# EAGLE design gyrotestbench (EAGLE 6.2)

## Sheet 1 of 9
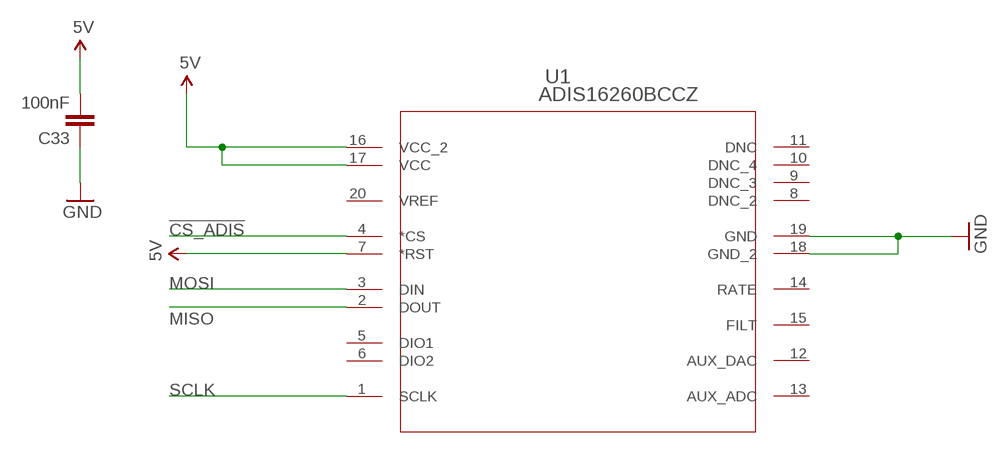
[diagram p0: schematic, sheet 1]

### Parts
C33  100nF  CAP0603-CAP  [0603-CAP]
U1  ADIS16260BCCZ  [LGA_CC-20-1]

### Nets
5V: C33.2 U1.7(*RST) U1.16(VCC_2) U1.17(VCC) ; also sheet 2,3,7,8,9
!CS_ADIS: U1.4(*CS) ; also sheet 9
GND: C33.1 U1.18(GND_2) U1.19(GND) ; also sheet 2,3,4,5,6,7,8,9
MISO: U1.2(DOUT) ; also sheet 2,7,9
MOSI: U1.3(DIN) ; also sheet 2,7,9
SCLK: U1.1(SCLK) ; also sheet 2,7,9
Unconnected: U1.5(DIO1) U1.6(DIO2) U1.8(DNC_2) U1.9(DNC_3) U1.10(DNC_4) U1.11(DNC) U1.12(AUX_DAC) U1.13(AUX_ADC) U1.14(RATE) U1.15(FILT) U1.20(VREF)

## Sheet 2 of 9
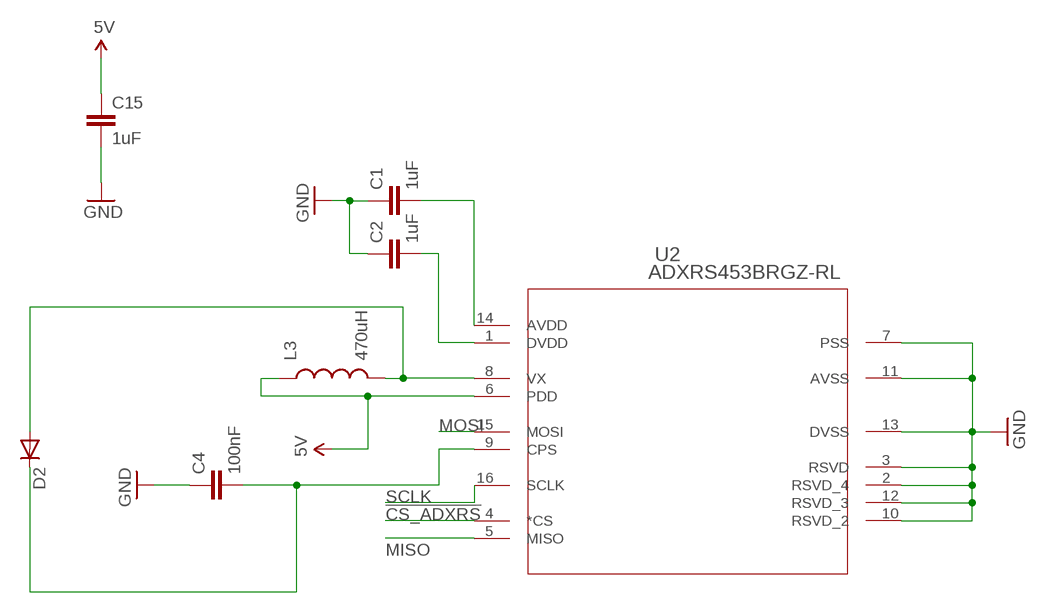
[diagram p1: schematic, sheet 2]

### Parts
C1  1uF  CAP0603-CAP  [0603-CAP]
C2  1uF  CAP0603-CAP  [0603-CAP]
C4  100nF  CAP0603-CAP  [0603-CAP]
C15  1uF  CAP0603-CAP  [0603-CAP]
D2  DIODEPTH  [DIODE-1N4001]
L3  470uH  INDUCTOR1210  [1210]
U2  ADXRS453BRGZ-RL  [RG_16_1]

### Nets
5V: C15.1 L3.1 U2.6(PDD) ; also sheet 1,3,7,8,9
!CS_ADXRS: U2.4(*CS) ; also sheet 9
GND: C1.1 C2.1 C4.1 C15.2 U2.2(RSVD_4) U2.3(RSVD) U2.7(PSS) U2.10(RSVD_2) U2.11(AVSS) U2.12(RSVD_3) U2.13(DVSS) ; also sheet 1,3,4,5,6,7,8,9
MISO: U2.5(MISO) ; also sheet 1,7,9
MOSI: U2.15(MOSI) ; also sheet 1,7,9
N$1: C1.2 U2.14(AVDD)
N$2: C2.2 U2.1(DVDD)
N$3: C4.2 D2.C U2.9(CPS)
N$4: D2.A L3.2 U2.8(VX)
SCLK: U2.16(SCLK) ; also sheet 1,7,9

## Sheet 3 of 9
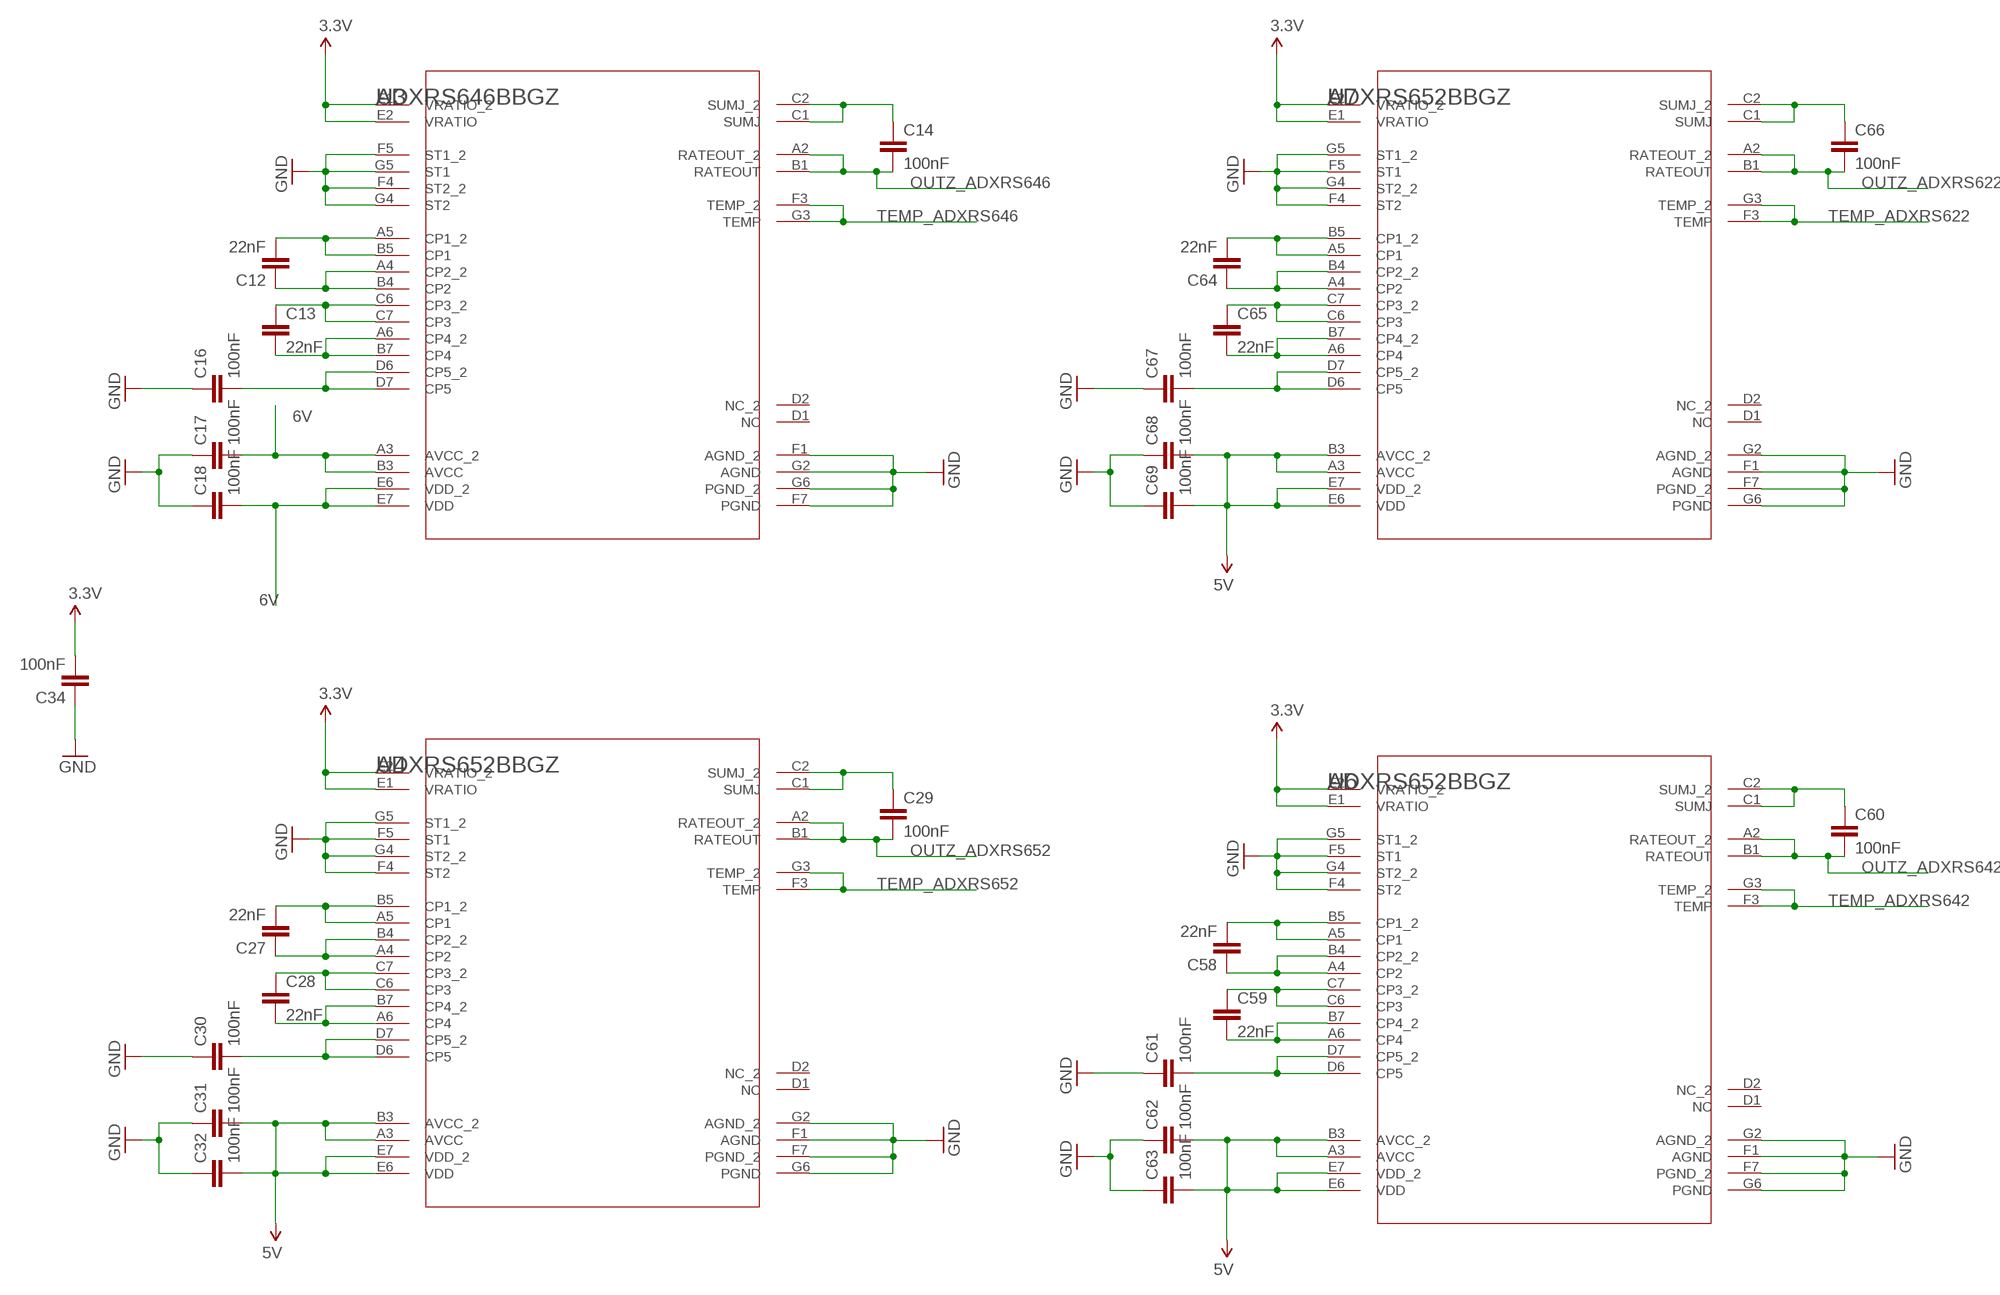
[diagram p2: schematic, sheet 3]

### Parts
C12  22nF  CAP0603-CAP  [0603-CAP]
C13  22nF  CAP0603-CAP  [0603-CAP]
C14  100nF  CAP0603-CAP  [0603-CAP]
C16  100nF  CAP0603-CAP  [0603-CAP]
C17  100nF  CAP0603-CAP  [0603-CAP]
C18  100nF  CAP0603-CAP  [0603-CAP]
C27  22nF  CAP0603-CAP  [0603-CAP]
C28  22nF  CAP0603-CAP  [0603-CAP]
C29  100nF  CAP0603-CAP  [0603-CAP]
C30  100nF  CAP0603-CAP  [0603-CAP]
C31  100nF  CAP0603-CAP  [0603-CAP]
C32  100nF  CAP0603-CAP  [0603-CAP]
C34  100nF  CAP0603-CAP  [0603-CAP]
C58  22nF  CAP0603-CAP  [0603-CAP]
C59  22nF  CAP0603-CAP  [0603-CAP]
C60  100nF  CAP0603-CAP  [0603-CAP]
C61  100nF  CAP0603-CAP  [0603-CAP]
C62  100nF  CAP0603-CAP  [0603-CAP]
C63  100nF  CAP0603-CAP  [0603-CAP]
C64  22nF  CAP0603-CAP  [0603-CAP]
C65  22nF  CAP0603-CAP  [0603-CAP]
C66  100nF  CAP0603-CAP  [0603-CAP]
C67  100nF  CAP0603-CAP  [0603-CAP]
C68  100nF  CAP0603-CAP  [0603-CAP]
C69  100nF  CAP0603-CAP  [0603-CAP]
U3  ADXRS646BBGZ  [BG_32_3]
U4  ADXRS652BBGZ  [BG_32_3]
U6  ADXRS652BBGZ  [BG_32_3]
U7  ADXRS652BBGZ  [BG_32_3]

### Nets
3.3V: C34.2 U3.E1(VRATIO_2) U3.E2(VRATIO) U4.E1(VRATIO) U4.E2(VRATIO_2) U6.E1(VRATIO) U6.E2(VRATIO_2) U7.E1(VRATIO) U7.E2(VRATIO_2) ; also sheet 4,5,6,8,9
5V: C31.2 C32.2 C62.2 C63.2 C68.2 C69.2 U4.A3(AVCC) U4.B3(AVCC_2) U4.E6(VDD) U4.E7(VDD_2) U6.A3(AVCC) U6.B3(AVCC_2) U6.E6(VDD) U6.E7(VDD_2) U7.A3(AVCC) U7.B3(AVCC_2) U7.E6(VDD) U7.E7(VDD_2) ; also sheet 1,2,7,8,9
6V: C17.2 C18.2 U3.A3(AVCC_2) U3.B3(AVCC) U3.E6(VDD_2) U3.E7(VDD) ; also sheet 8
GND: C16.1 C17.1 C18.1 C30.1 C31.1 C32.1 C34.1 C61.1 C62.1 C63.1 C67.1 C68.1 C69.1 U3.F1(AGND_2) U3.F4(ST2_2) U3.F5(ST1_2) U3.F7(PGND) U3.G2(AGND) U3.G4(ST2) U3.G5(ST1) U3.G6(PGND_2) U4.F1(AGND) U4.F4(ST2) U4.F5(ST1) U4.F7(PGND_2) U4.G2(AGND_2) U4.G4(ST2_2) U4.G5(ST1_2) U4.G6(PGND) U6.F1(AGND) U6.F4(ST2) U6.F5(ST1) U6.F7(PGND_2) U6.G2(AGND_2) U6.G4(ST2_2) U6.G5(ST1_2) U6.G6(PGND) U7.F1(AGND) U7.F4(ST2) U7.F5(ST1) U7.F7(PGND_2) U7.G2(AGND_2) U7.G4(ST2_2) U7.G5(ST1_2) U7.G6(PGND) ; also sheet 1,2,4,5,6,7,8,9
N$8: C12.2 U3.A5(CP1_2) U3.B5(CP1)
N$9: C12.1 U3.A4(CP2_2) U3.B4(CP2)
N$10: C13.1 U3.C6(CP3_2) U3.C7(CP3)
N$11: C13.2 U3.A6(CP4_2) U3.B7(CP4)
N$17: C14.1 U3.C1(SUMJ) U3.C2(SUMJ_2)
N$19: C16.2 U3.D6(CP5_2) U3.D7(CP5)
N$24: C27.2 U4.A5(CP1) U4.B5(CP1_2)
N$25: C27.1 U4.A4(CP2) U4.B4(CP2_2)
N$26: C28.1 U4.C6(CP3) U4.C7(CP3_2)
N$27: C28.2 U4.A6(CP4) U4.B7(CP4_2)
N$28: C29.1 U4.C1(SUMJ) U4.C2(SUMJ_2)
N$29: C30.2 U4.D6(CP5) U4.D7(CP5_2)
N$62: C58.2 U6.A5(CP1) U6.B5(CP1_2)
N$63: C58.1 U6.A4(CP2) U6.B4(CP2_2)
N$64: C59.1 U6.C6(CP3) U6.C7(CP3_2)
N$65: C59.2 U6.A6(CP4) U6.B7(CP4_2)
N$66: C60.1 U6.C1(SUMJ) U6.C2(SUMJ_2)
N$67: C61.2 U6.D6(CP5) U6.D7(CP5_2)
N$68: C64.2 U7.A5(CP1) U7.B5(CP1_2)
N$69: C64.1 U7.A4(CP2) U7.B4(CP2_2)
N$70: C65.1 U7.C6(CP3) U7.C7(CP3_2)
N$71: C65.2 U7.A6(CP4) U7.B7(CP4_2)
N$72: C66.1 U7.C1(SUMJ) U7.C2(SUMJ_2)
N$73: C67.2 U7.D6(CP5) U7.D7(CP5_2)
OUTZ_ADXRS622: C66.2 U7.A2(RATEOUT_2) U7.B1(RATEOUT) ; also sheet 7
OUTZ_ADXRS642: C60.2 U6.A2(RATEOUT_2) U6.B1(RATEOUT) ; also sheet 7
OUTZ_ADXRS646: C14.2 U3.A2(RATEOUT_2) U3.B1(RATEOUT) ; also sheet 7
OUTZ_ADXRS652: C29.2 U4.A2(RATEOUT_2) U4.B1(RATEOUT) ; also sheet 7
TEMP_ADXRS622: U7.F3(TEMP) U7.G3(TEMP_2) ; also sheet 7
TEMP_ADXRS642: U6.F3(TEMP) U6.G3(TEMP_2) ; also sheet 7
TEMP_ADXRS646: U3.F3(TEMP_2) U3.G3(TEMP) ; also sheet 7
TEMP_ADXRS652: U4.F3(TEMP) U4.G3(TEMP_2) ; also sheet 7
Unconnected: U3.D1(NC) U3.D2(NC_2) U4.D1(NC) U4.D2(NC_2) U6.D1(NC) U6.D2(NC_2) U7.D1(NC) U7.D2(NC_2)

## Sheet 4 of 9
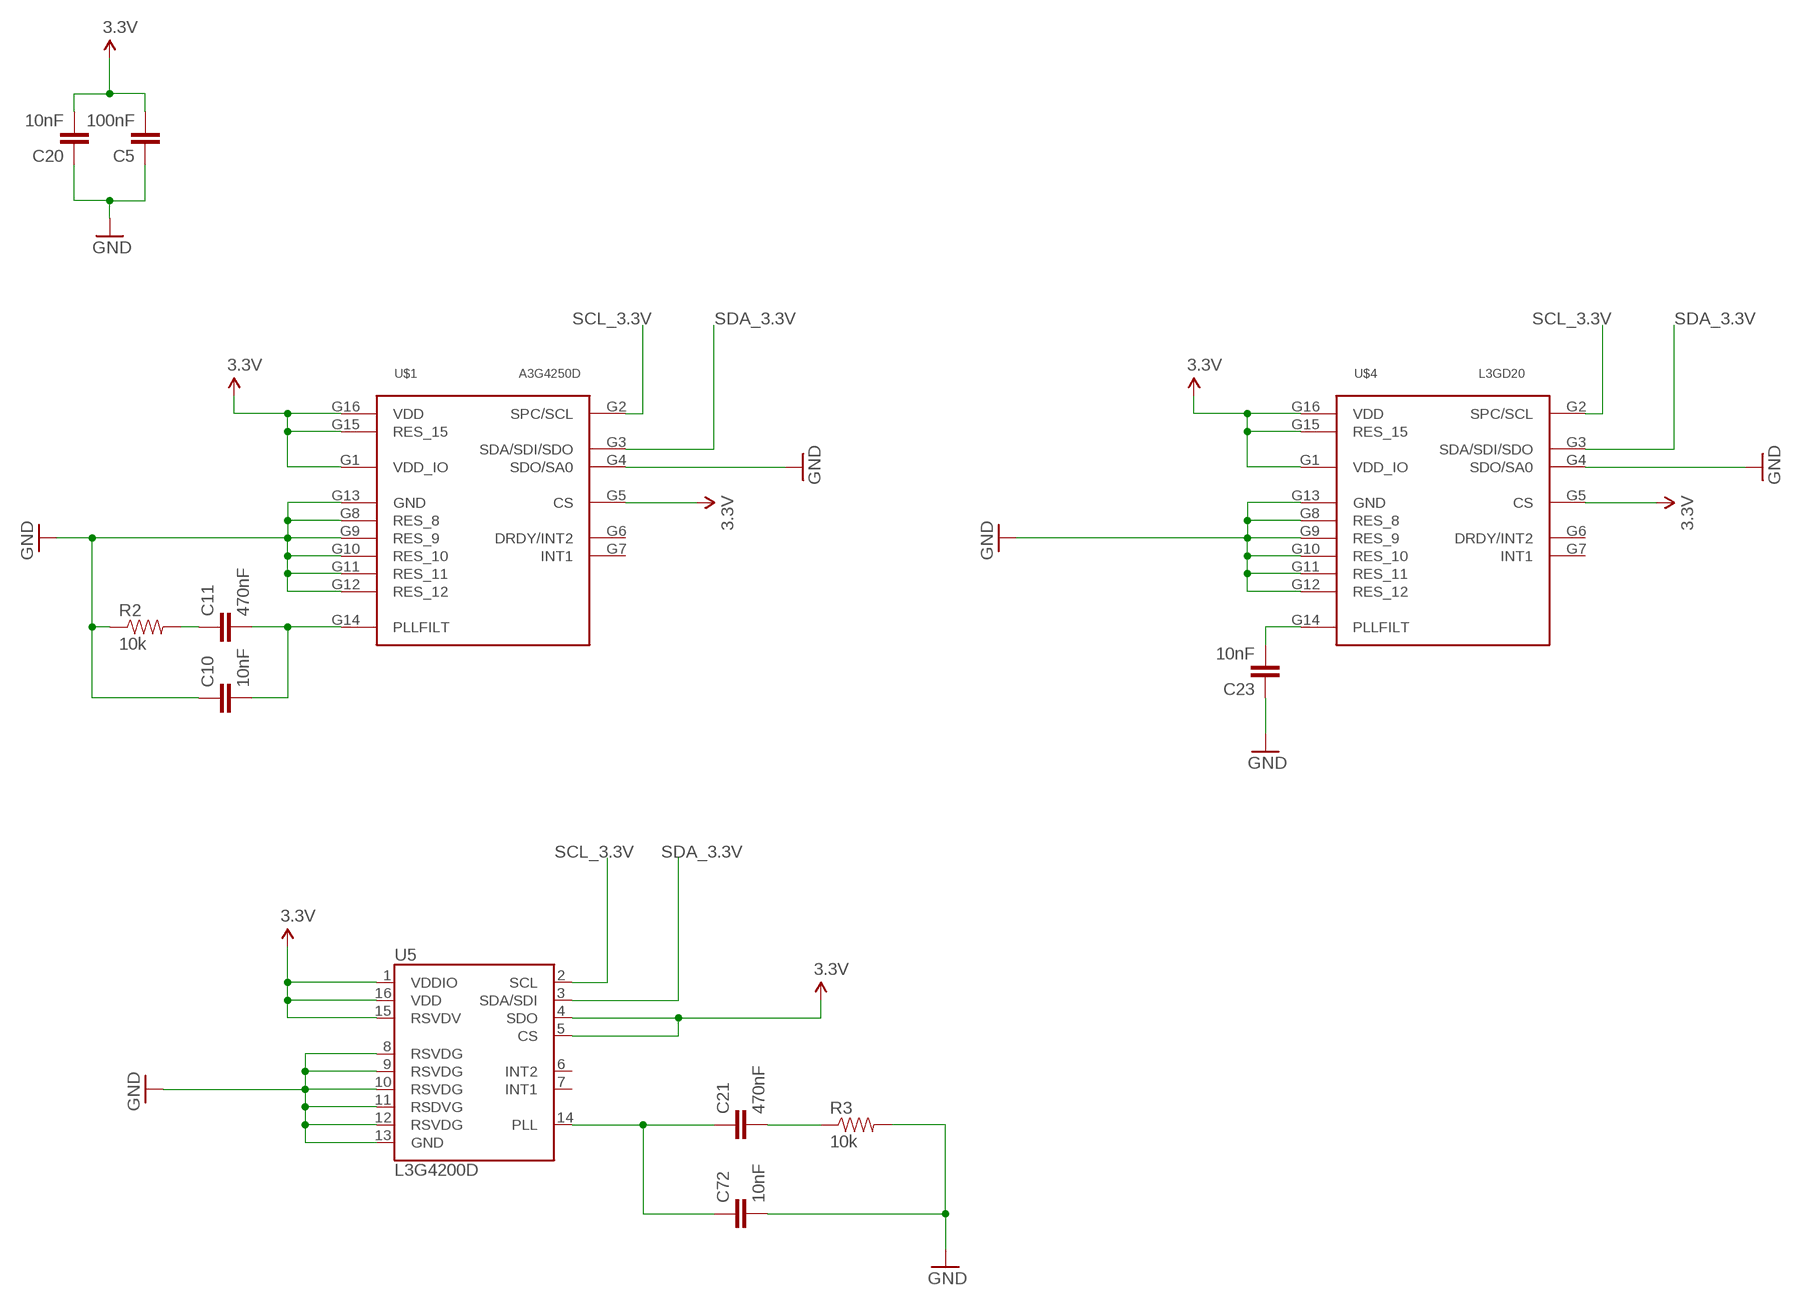
[diagram p3: schematic, sheet 4]

### Parts
C5  100nF  CAP0603-CAP  [0603-CAP]
C10  10nF  CAP0603-CAP  [0603-CAP]
C11  470nF  CAP0603-CAP  [0603-CAP]
C20  10nF  CAP0603-CAP  [0603-CAP]
C21  470nF  CAP0603-CAP  [0603-CAP]
C23  10nF  CAP0603-CAP  [0603-CAP]
C72  10nF  CAP0603-CAP  [0603-CAP]
R2  10k  RESISTOR0603-RES  [0603-RES]
R3  10k  RESISTOR0603-RES  [0603-RES]
U5  L3G4200D  [LGA16-4X4]
U$1  A3G4250D  [LGA-16]
U$4  L3GD20  [LGA-16]

### Nets
3.3V: C5.2 C20.2 U5.1(VDDIO) U5.4(SDO) U5.5(CS) U5.15(RSVDV) U5.16(VDD) U$1.G1(VDD_IO) U$1.G5(CS) U$1.G15(RES_15) U$1.G16(VDD) U$4.G1(VDD_IO) U$4.G5(CS) U$4.G15(RES_15) U$4.G16(VDD) ; also sheet 3,5,6,8,9
GND: C5.1 C10.1 C20.1 C23.1 C72.2 R2.1 R3.2 U5.8(RSVDG) U5.9(RSVDG) U5.10(RSVDG) U5.11(RSDVG) U5.12(RSVDG) U5.13(GND) U$1.G4(SDO/SA0) U$1.G8(RES_8) U$1.G9(RES_9) U$1.G10(RES_10) U$1.G11(RES_11) U$1.G12(RES_12) U$1.G13(GND) U$4.G4(SDO/SA0) U$4.G8(RES_8) U$4.G9(RES_9) U$4.G10(RES_10) U$4.G11(RES_11) U$4.G12(RES_12) U$4.G13(GND) ; also sheet 1,2,3,5,6,7,8,9
N$5: C21.1 C72.1 U5.14(PLL)
N$12: C10.2 C11.2 U$1.G14(PLLFILT)
N$13: C11.1 R2.2
N$14: C21.2 R3.1
N$15: C23.2 U$4.G14(PLLFILT)
SCL_3.3V: U5.2(SCL) U$1.G2(SPC/SCL) U$4.G2(SPC/SCL) ; also sheet 6,9
SDA_3.3V: U5.3(SDA/SDI) U$1.G3(SDA/SDI/SDO) U$4.G3(SDA/SDI/SDO) ; also sheet 6,9
Unconnected: U5.6(INT2) U5.7(INT1) U$1.G6(DRDY/INT2) U$1.G7(INT1) U$4.G6(DRDY/INT2) U$4.G7(INT1)

## Sheet 5 of 9
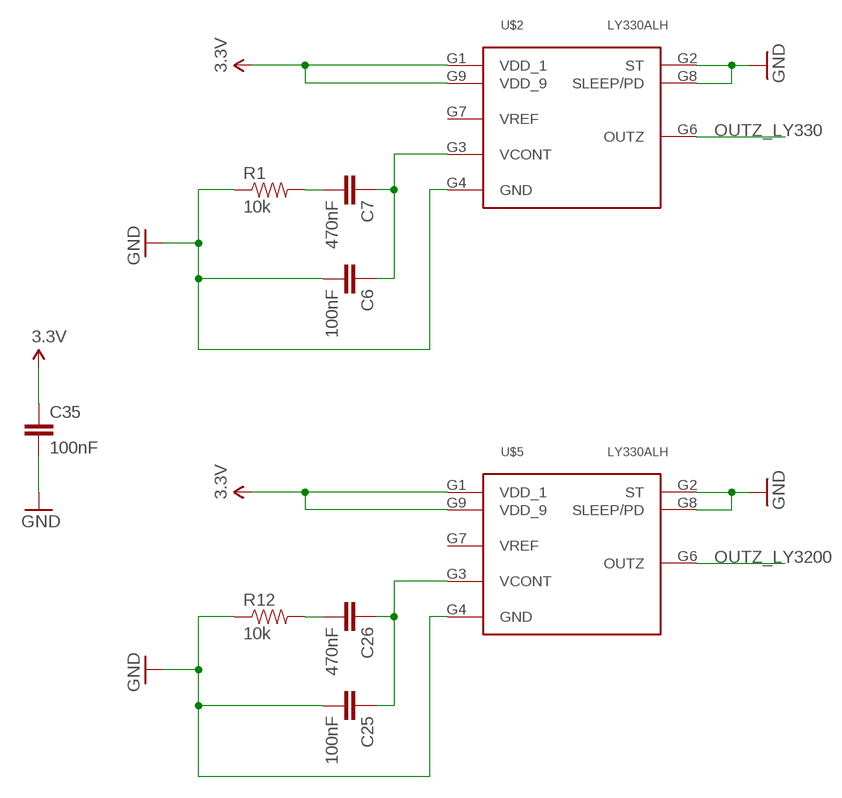
[diagram p4: schematic, sheet 5]

### Parts
C6  100nF  CAP0603-CAP  [0603-CAP]
C7  470nF  CAP0603-CAP  [0603-CAP]
C25  100nF  CAP0603-CAP  [0603-CAP]
C26  470nF  CAP0603-CAP  [0603-CAP]
C35  100nF  CAP0603-CAP  [0603-CAP]
R1  10k  RESISTOR0603-RES  [0603-RES]
R12  10k  RESISTOR0603-RES  [0603-RES]
U$2  LY330ALH  [LGA-10]
U$5  LY330ALH  [LGA-10]

### Nets
3.3V: C35.1 U$2.G1(VDD_1) U$2.G9(VDD_9) U$5.G1(VDD_1) U$5.G9(VDD_9) ; also sheet 3,4,6,8,9
GND: C6.2 C25.2 C35.2 R1.1 R12.1 U$2.G2(ST) U$2.G4(GND) U$2.G8(SLEEP/PD) U$5.G2(ST) U$5.G4(GND) U$5.G8(SLEEP/PD) ; also sheet 1,2,3,4,6,7,8,9
N$6: C7.2 R1.2
N$7: C6.1 C7.1 U$2.G3(VCONT)
N$22: C25.1 C26.1 U$5.G3(VCONT)
N$23: C26.2 R12.2
OUTZ_LY330: U$2.G6(OUTZ) ; also sheet 7
OUTZ_LY3200: U$5.G6(OUTZ) ; also sheet 7
Unconnected: U$2.G7(VREF) U$5.G7(VREF)

## Sheet 6 of 9
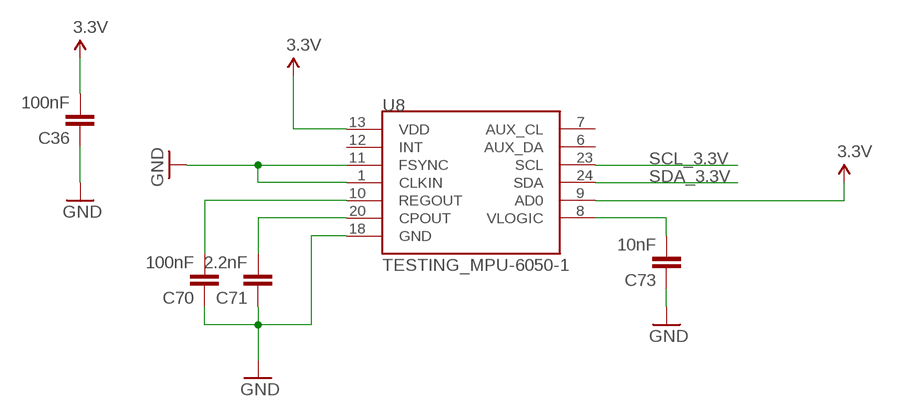
[diagram p5: schematic, sheet 6]

### Parts
C36  100nF  CAP0603-CAP  [0603-CAP]
C70  100nF  CAP0603-CAP  [0603-CAP]
C71  2.2nF  CAP0603-CAP  [0603-CAP]
C73  10nF  CAP0603-CAP  [0603-CAP]
U8  TESTING_MPU-6050-1  [TESTING_QFN-24-4MM2]

### Nets
3.3V: C36.2 U8.9(AD0) U8.13(VDD) ; also sheet 3,4,5,8,9
GND: C36.1 C70.1 C71.1 C73.1 U8.1(CLKIN) U8.11(FSYNC) U8.18(GND) ; also sheet 1,2,3,4,5,7,8,9
N$38: C70.2 U8.10(REGOUT)
N$39: C71.2 U8.20(CPOUT)
N$41: C73.2 U8.8(VLOGIC)
SCL_3.3V: U8.23(SCL) ; also sheet 4,9
SDA_3.3V: U8.24(SDA) ; also sheet 4,9
Unconnected: U8.6(AUX_DA) U8.7(AUX_CL) U8.12(INT)

## Sheet 7 of 9
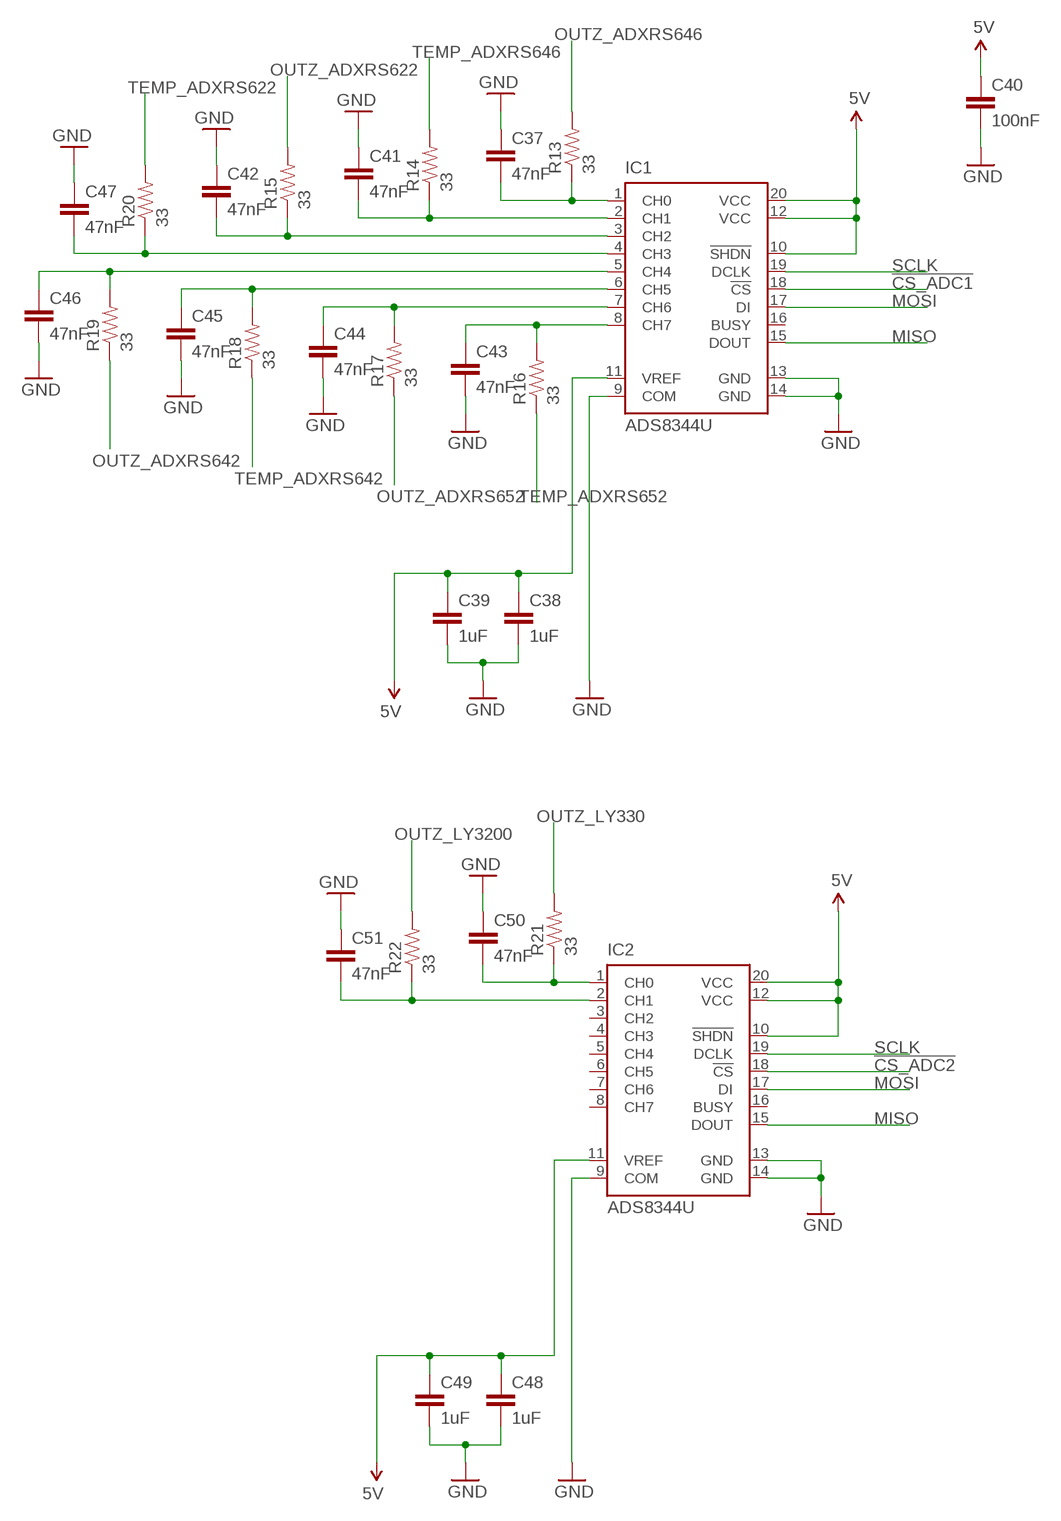
[diagram p6: schematic, sheet 7]

### Parts
C37  47nF  CAP0603-CAP  [0603-CAP]
C38  1uF  CAP0603-CAP  [0603-CAP]
C39  1uF  CAP0603-CAP  [0603-CAP]
C40  100nF  CAP0603-CAP  [0603-CAP]
C41  47nF  CAP0603-CAP  [0603-CAP]
C42  47nF  CAP0603-CAP  [0603-CAP]
C43  47nF  CAP0603-CAP  [0603-CAP]
C44  47nF  CAP0603-CAP  [0603-CAP]
C45  47nF  CAP0603-CAP  [0603-CAP]
C46  47nF  CAP0603-CAP  [0603-CAP]
C47  47nF  CAP0603-CAP  [0603-CAP]
C48  1uF  CAP0603-CAP  [0603-CAP]
C49  1uF  CAP0603-CAP  [0603-CAP]
C50  47nF  CAP0603-CAP  [0603-CAP]
C51  47nF  CAP0603-CAP  [0603-CAP]
IC1  ADS8344U  [SSOP20BU]
IC2  ADS8344U  [SSOP20BU]
R13  33  RESISTOR0603-RES  [0603-RES]
R14  33  RESISTOR0603-RES  [0603-RES]
R15  33  RESISTOR0603-RES  [0603-RES]
R16  33  RESISTOR0603-RES  [0603-RES]
R17  33  RESISTOR0603-RES  [0603-RES]
R18  33  RESISTOR0603-RES  [0603-RES]
R19  33  RESISTOR0603-RES  [0603-RES]
R20  33  RESISTOR0603-RES  [0603-RES]
R21  33  RESISTOR0603-RES  [0603-RES]
R22  33  RESISTOR0603-RES  [0603-RES]

### Nets
5V: C38.1 C39.1 C40.1 C48.1 C49.1 IC1.10(!SHDN) IC1.11(VREF) IC1.12(VCC) IC1.20(VCC) IC2.10(!SHDN) IC2.11(VREF) IC2.12(VCC) IC2.20(VCC) ; also sheet 1,2,3,8,9
!CS_ADC1: IC1.18(!CS) ; also sheet 9
!CS_ADC2: IC2.18(!CS) ; also sheet 9
GND: C37.1 C38.2 C39.2 C40.2 C41.1 C42.1 C43.2 C44.2 C45.2 C46.2 C47.1 C48.2 C49.2 C50.1 C51.1 IC1.9(COM) IC1.13(GND) IC1.14(GND) IC2.9(COM) IC2.13(GND) IC2.14(GND) ; also sheet 1,2,3,4,5,6,8,9
MISO: IC1.15(DOUT) IC2.15(DOUT) ; also sheet 1,2,9
MOSI: IC1.17(DI) IC2.17(DI) ; also sheet 1,2,9
N$30: C37.2 IC1.1(CH0) R13.1
N$31: C41.2 IC1.2(CH1) R14.1
N$32: C42.2 IC1.3(CH2) R15.1
N$33: C43.1 IC1.8(CH7) R16.2
N$34: C44.1 IC1.7(CH6) R17.2
N$35: C45.1 IC1.6(CH5) R18.2
N$36: C47.2 IC1.4(CH3) R20.1
N$37: C46.1 IC1.5(CH4) R19.2
N$46: C50.2 IC2.1(CH0) R21.1
N$47: C51.2 IC2.2(CH1) R22.1
OUTZ_ADXRS622: R15.2 ; also sheet 3
OUTZ_ADXRS642: R19.1 ; also sheet 3
OUTZ_ADXRS646: R13.2 ; also sheet 3
OUTZ_ADXRS652: R17.1 ; also sheet 3
OUTZ_LY330: R21.2 ; also sheet 5
OUTZ_LY3200: R22.2 ; also sheet 5
SCLK: IC1.19(DCLK) IC2.19(DCLK) ; also sheet 1,2,9
TEMP_ADXRS622: R20.2 ; also sheet 3
TEMP_ADXRS642: R18.1 ; also sheet 3
TEMP_ADXRS646: R14.2 ; also sheet 3
TEMP_ADXRS652: R16.1 ; also sheet 3
Unconnected: IC1.16(BUSY) IC2.3(CH2) IC2.4(CH3) IC2.5(CH4) IC2.6(CH5) IC2.7(CH6) IC2.8(CH7) IC2.16(BUSY)

## Sheet 8 of 9
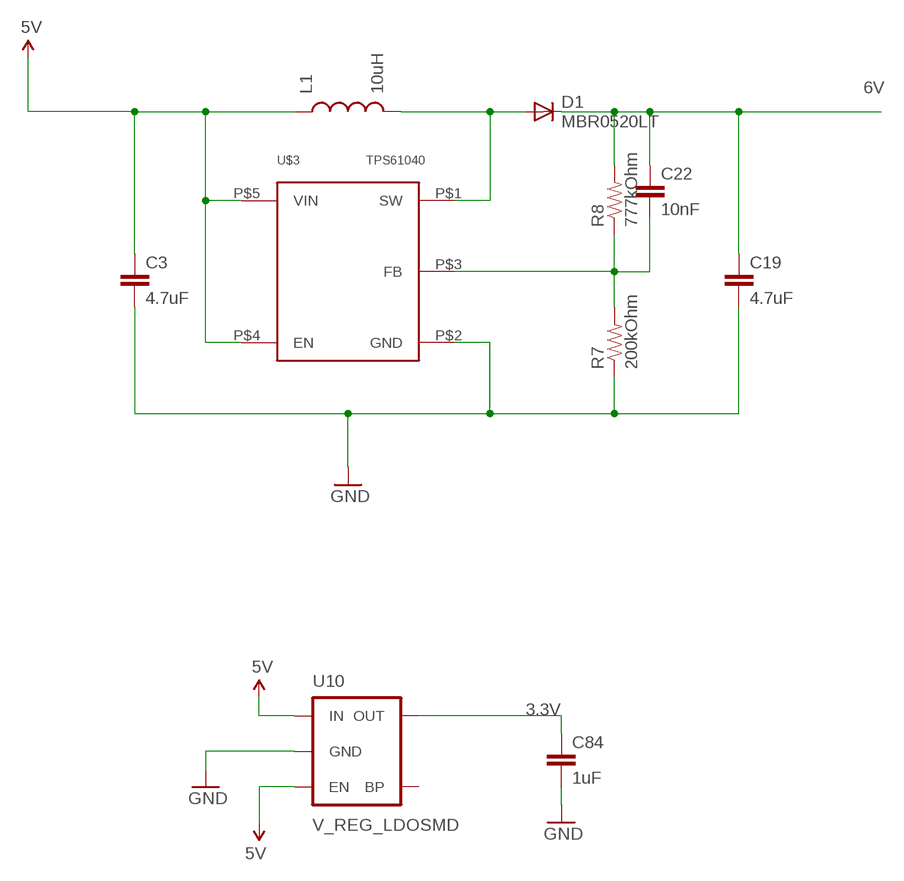
[diagram p7: schematic, sheet 8]

### Parts
C3  4.7uF  CAP0603-CAP  [0603-CAP]
C19  4.7uF  CAP0603-CAP  [0603-CAP]
C22  10nF  CAP0603-CAP  [0603-CAP]
C84  1uF  CAP0603-CAP  [0603-CAP]
D1  MBR0520LT  [SOD123]
L1  10uH  INDUCTOR1210  [1210]
R7  200kOhm  RESISTOR0603-RES  [0603-RES]
R8  777kOhm  RESISTOR0603-RES  [0603-RES]
U10  V_REG_LDOSMD  [SOT23-5]
U$3  TPS61040  [DBV]

### Nets
3.3V: C84.1 U10.5(OUT) ; also sheet 3,4,5,6,9
5V: C3.1 L1.1 U10.1(IN) U10.3(EN) U$3.P$4(EN) U$3.P$5(VIN) ; also sheet 1,2,3,7,9
6V: C19.1 C22.1 D1.C R8.2 ; also sheet 3
GND: C3.2 C19.2 C84.2 R7.1 U10.2(GND) U$3.P$2(GND) ; also sheet 1,2,3,4,5,6,7,9
N$18: D1.A L1.2 U$3.P$1(SW)
N$20: C22.2 R7.2 R8.1 U$3.P$3(FB)
Unconnected: U10.4(BP)

## Sheet 9 of 9
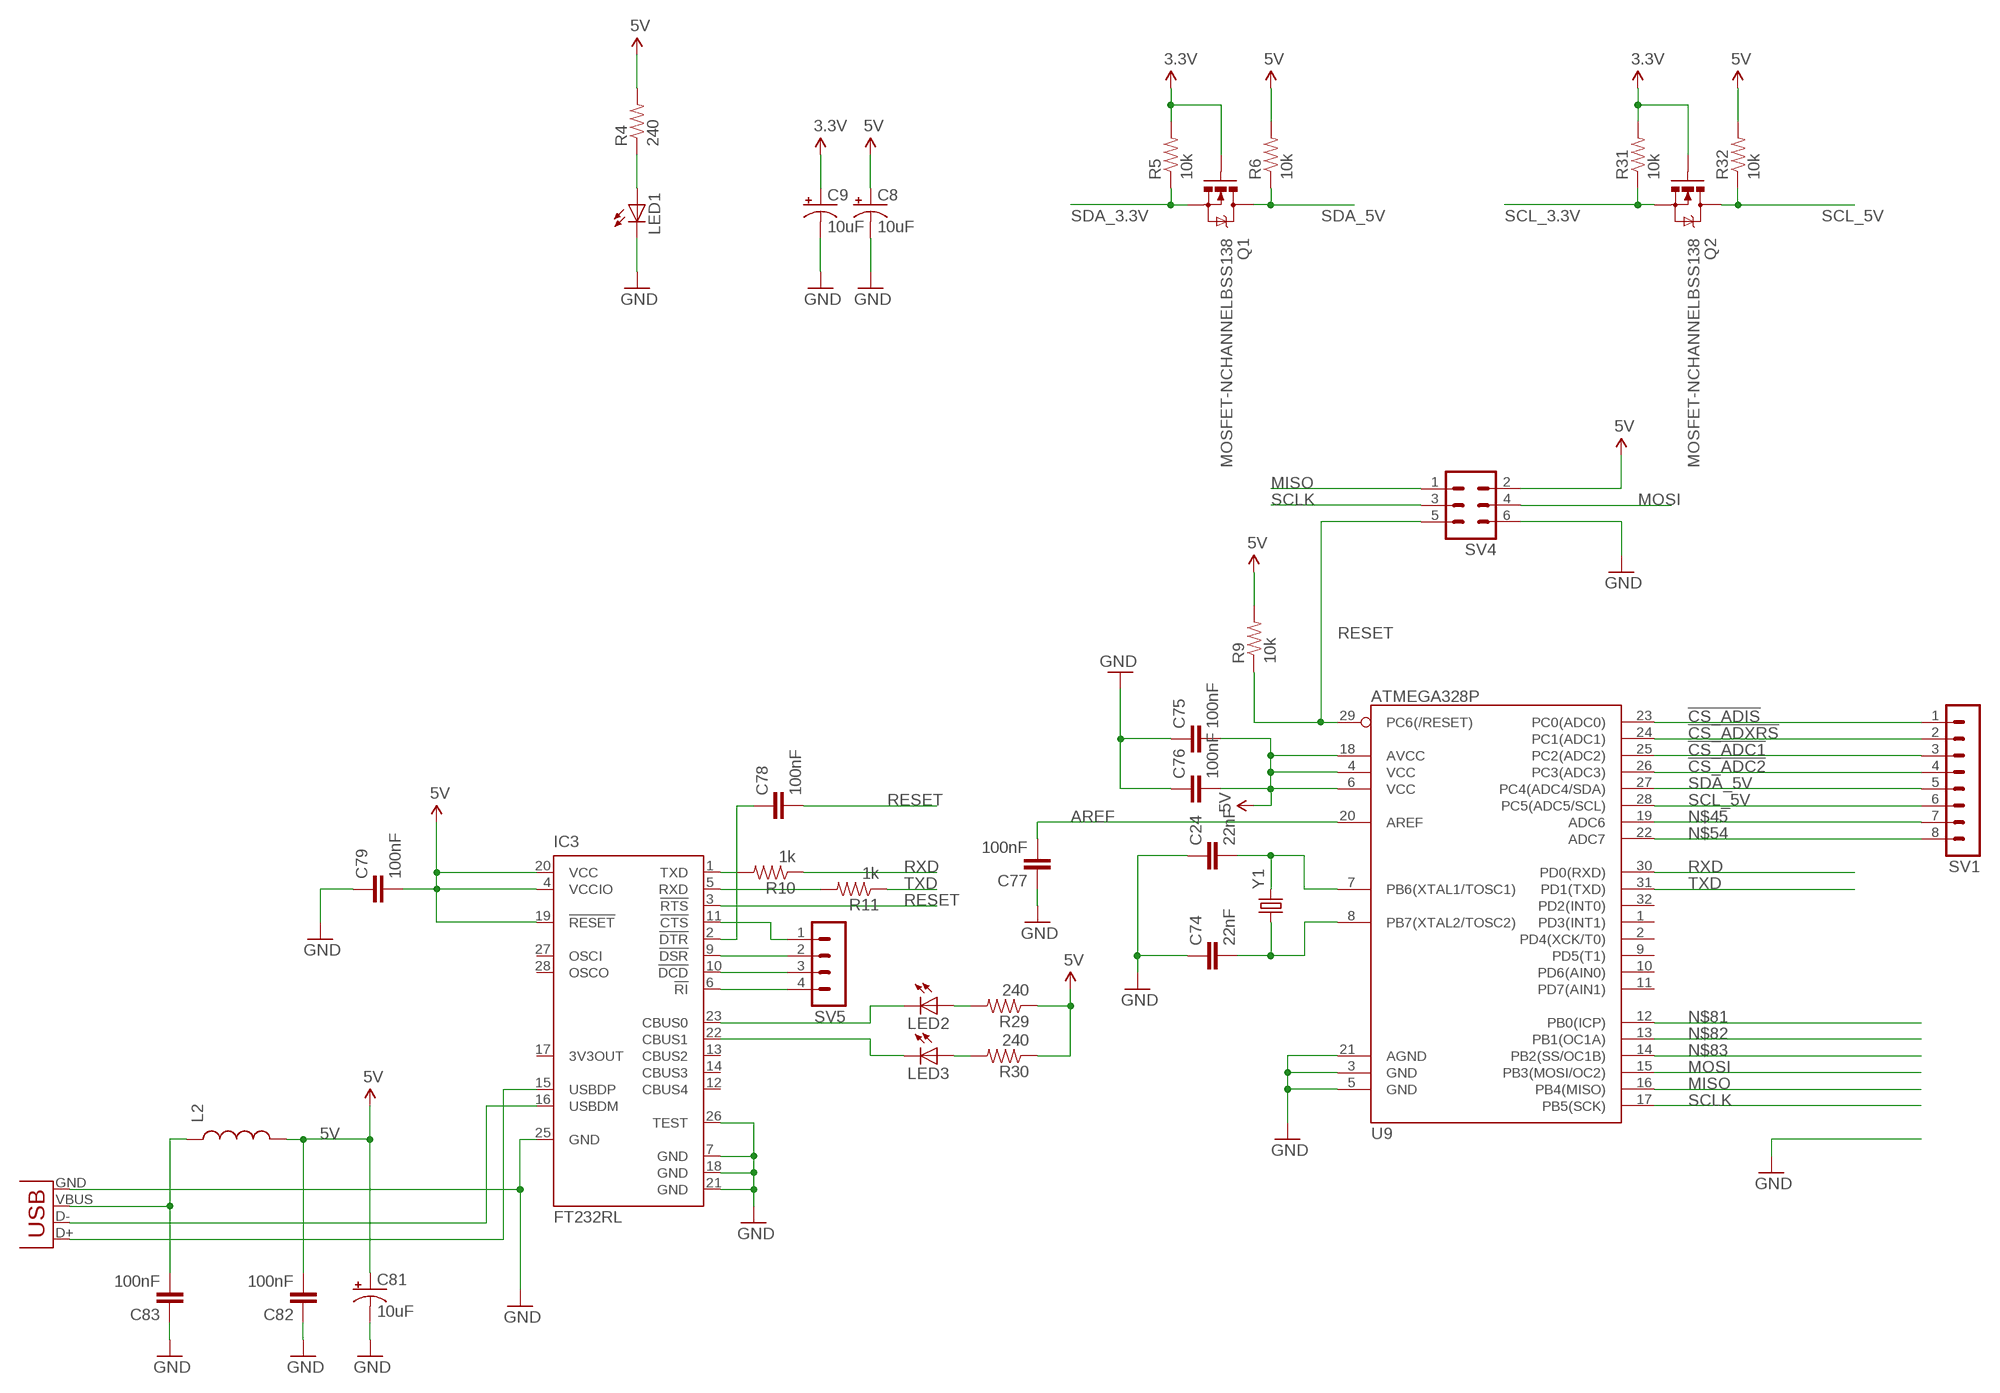
[diagram p8: schematic, sheet 9]

### Parts
C8  10uF  CPOL-USB  [PANASONIC_B]
C9  10uF  CPOL-USB  [PANASONIC_B]
C24  22nF  CAP0603-CAP  [0603-CAP]
C74  22nF  CAP0603-CAP  [0603-CAP]
C75  100nF  CAP0603-CAP  [0603-CAP]
C76  100nF  CAP0603-CAP  [0603-CAP]
C77  100nF  CAP0603-CAP  [0603-CAP]
C78  100nF  CAP0603-CAP  [0603-CAP]
C79  100nF  CAP0603-CAP  [0603-CAP]
C81  10uF  CPOL-USB  [PANASONIC_B]
C82  100nF  CAP0603-CAP  [0603-CAP]
C83  100nF  CAP0603-CAP  [0603-CAP]
IC3  FT232RL  [SSOP28]
JP1  USBSMD  [USB-MINIB]
L2  INDUCTOR0603  [0603]
LED1  LED0603  [LED-0603]
LED2  LED0603  [LED-0603]
LED3  LED0603  [LED-0603]
Q1  MOSFET-NCHANNELBSS138  [SOT23]
Q2  MOSFET-NCHANNELBSS138  [SOT23]
R4  240  RESISTOR0603-RES  [0603-RES]
R5  10k  RESISTOR0603-RES  [0603-RES]
R6  10k  RESISTOR0603-RES  [0603-RES]
R9  10k  RESISTOR0603-RES  [0603-RES]
R10  1k  RESISTOR0603-RES  [0603-RES]
R11  1k  RESISTOR0603-RES  [0603-RES]
R29  240  RESISTOR0603-RES  [0603-RES]
R30  240  RESISTOR0603-RES  [0603-RES]
R31  10k  RESISTOR0603-RES  [0603-RES]
R32  10k  RESISTOR0603-RES  [0603-RES]
SV1  MA08-1  [MA08-1]
SV4  MA03-2  [MA03-2]
SV5  MA04-1  [MA04-1]
U9  ATMEGA328P  ATMEGA328_SMT  [TQFP32-08]
Y1  CRYSTALHC49US  [HC49US]

### Nets
3.3V: C9.+ Q1.1(G) Q2.1(G) R5.2 R31.2 ; also sheet 3,4,5,6,8
5V: C8.+ C75.2 C76.2 C79.2 C81.+ C82.2 IC3.4(VCCIO) IC3.19(!RESET) IC3.20(VCC) L2.2 R4.2 R6.2 R9.2 R29.1 R30.1 R32.2 SV4.2 U9.4(VCC) U9.6(VCC) U9.18(AVCC) ; also sheet 1,2,3,7,8
!CS_ADC1: SV1.3 U9.25(PC2(ADC2)) ; also sheet 7
!CS_ADC2: SV1.4 U9.26(PC3(ADC3)) ; also sheet 7
!CS_ADIS: SV1.1 U9.23(PC0(ADC0)) ; also sheet 1
!CS_ADXRS: SV1.2 U9.24(PC1(ADC1)) ; also sheet 2
AREF: C77.2 U9.20(AREF)
GND: C8.- C9.- C24.1 C74.1 C75.1 C76.1 C77.1 C79.1 C81.- C82.1 C83.1 IC3.7(GND) IC3.18(GND) IC3.21(GND) IC3.25(GND) IC3.26(TEST) JP1.GND LED1.C SV4.6 U9.3(GND) U9.5(GND) U9.21(AGND) ; also sheet 1,2,3,4,5,6,7,8
MISO: SV4.1 U9.16(PB4(MISO)) ; also sheet 1,2,7
MOSI: SV4.4 U9.15(PB3(MOSI/OC2)) ; also sheet 1,2,7
N$45: SV1.7 U9.19(ADC6)
N$54: SV1.8 U9.22(ADC7)
N$55: IC3.1(TXD) R10.2
N$74: C78.1 IC3.2(!DTR)
N$81: U9.12(PB0(ICP))
N$82: U9.13(PB1(OC1A))
N$83: U9.14(PB2(SS/OC1B))
N$84: IC3.5(RXD) R11.2
N$85: IC3.11(!CTS) SV5.1
N$86: IC3.9(!DSR) SV5.2
N$87: C24.2 U9.7(PB6(XTAL1/TOSC1)) Y1.2
N$88: C74.2 U9.8(PB7(XTAL2/TOSC2)) Y1.1
N$89: LED1.A R4.1
N$91: IC3.10(!DCD) SV5.3
N$92: IC3.6(!RI) SV5.4
N$93: IC3.23(CBUS0) LED2.C
N$94: IC3.22(CBUS1) LED3.C
N$95: LED2.A R29.2
N$96: LED3.A R30.2
N$98: IC3.15(USBDP) JP1.D+
N$99: IC3.16(USBDM) JP1.D-
N$101: C83.2 JP1.VBUS L2.1
RESET: C78.2 IC3.3(!RTS) R9.1 SV4.5 U9.29(PC6(/RESET))
RXD: R10.1 U9.30(PD0(RXD))
SCL_3.3V: Q2.2(S) R31.1 ; also sheet 4,6
SCL_5V: Q2.3(D) R32.1 SV1.6 U9.28(PC5(ADC5/SCL))
SCLK: SV4.3 U9.17(PB5(SCK)) ; also sheet 1,2,7
SDA_3.3V: Q1.2(S) R5.1 ; also sheet 4,6
SDA_5V: Q1.3(D) R6.1 SV1.5 U9.27(PC4(ADC4/SDA))
TXD: R11.1 U9.31(PD1(TXD))
Unconnected: IC3.12(CBUS4) IC3.13(CBUS2) IC3.14(CBUS3) IC3.17(3V3OUT) IC3.27(OSCI) IC3.28(OSCO) U9.1(PD3(INT1)) U9.2(PD4(XCK/T0)) U9.9(PD5(T1)) U9.10(PD6(AIN0)) U9.11(PD7(AIN1)) U9.32(PD2(INT0))

## Library data of the parts
C1-C7 C10-C51 C58-C79 C82-C84 = SparkFun-Capacitors:CAP: Capacitor Standard 0603 ceramic capacitor, and 0.1" leaded capacitor.
C8 C9 C81 = rcl:CPOL-US: POLARIZED CAPACITOR, American symbol
D1 = diode:MBR0520LT: SCHOTTKY BARRIER RECTIFIER Source: http://onsemi.com .. MBR0520LT1-D.pdf
D2 = SparkFun-DiscreteSemi:DIODE: Diode These are standard reverse protection diodes and small signal diodes. SMA package can handle up to about 1A. SOD-323 can handle about 200mA. What the SOD-323 package when ordering, there are some mfgs out there that are 5-pin packages.
IC1 IC2 = burr-brown:ADS8344: 16-Bit, 8-Channel Serial Output Sampling ADC; MPN: ADS8344NB; OC_FARNELL: 1212294; OC_NEWARK: 01M6827
IC3 = ftdichip:FT232R: Source: http://www.ftdichip.com/Documents/DataSheets/DS_FT232R_v104.pdf; MPN: FT232RL; OC_FARNELL: 1146032; OC_NEWARK: 91K9918
JP1 = SparkFun-Connectors:USB: USB Connectors USB-B-PTH is fully proven SKU : PRT-00139/CONN-08278 USB-miniB is fully proven SKU : PRT-00587 USB-A-PCB is untested. USB-A-H is throughly reviewed, but untested. Spark Fun Electronics SKU : PRT-00437 USB-B-SMT is throughly reviewed, but untested. Needs silkscreen touching up. USB-A-S has not been used/tested USB-MB-H has not been used/tested USB-MICROB has been used. CONN-09505
L1-L3 = SparkFun-Passives:INDUCTOR: Inductors Basic Inductor/Choke - 0603 and 1206. Footprints are not proven and vary greatly between part numbers.
LED1-LED3 = SparkFun-LED:LED: LEDs Standard schematic elements and footprints for 5mm, 3mm, 1206, and 0603 sized LEDs. 5mm - Spark Fun Electronics SKU : COM-00529 (and others)
Q1 Q2 = SparkFun-DiscreteSemi:MOSFET-NCHANNEL: Common NMOSFET Parts MFG P/N Store ID Prod ID FDD8780 TRANS-09984 SI7820DN TRANS-11055 FDS6630A IC-08089 2N7002PW TRANS-11151 FQP30N06L COM-10213 TRANS-10060 BSS123LT1G TRANS-08345 BSS138 TRANS-00830 BS170 2N7000; PROD_ID: TRANS-00830
R1-R22 R29-R32 = SparkFun-Resistors:RESISTOR: Resistor Basic schematic elements and footprints for 0603, 1206, and PTH resistors.
SV1 = con-lstb:MA08-1: PIN HEADER; OC_FARNELL: unknown; OC_NEWARK: unknown
SV4 = con-lstb:MA03-2: PIN HEADER; OC_FARNELL: unknown; OC_NEWARK: unknown
SV5 = con-lstb:MA04-1: PIN HEADER; OC_FARNELL: unknown; OC_NEWARK: unknown
U1 = gyrolib:ADIS16260BCCZ
U2 = gyrolib:ADXRS453BRGZ-RL
U3 = gyrolib:ADXRS646BBGZ; MANUFACTURER_PART_NUMBER: ADXRS613BBGZ; VENDOR: Vendor
U4 U6 U7 = gyrolib:ADXRS652BBGZ
U5 = SparkFun-Sensors:L3G4200D: L3G4200D Three-axis, digital output gyroscope The L3G4200D is a low-power three-axis angular rate sensor, has a full scale of ±250/±500/±2000 dps and is capable of measuring rates with a user-selectable bandwidth. It includes a sensing element and an IC interface capable of providing the measured angular rate to the external world through a digital interface (I2C/SPI). Package: 4x4x1.1 LGA-16 (LGA16-4x4.PAC)
U8 = MPU-6050_Breakout_V11:TESTING_MPU-6050
U9 = SparkFun-DigitalIC:ATMEGA328_SMT: 32-Pin Atmega328 part Commonly used on Arduino compatible boards Available in QFP and QFN packages TQFP is IC-09069 QFN is non-stock; PROD_ID: IC-09069
U10 = SparkFun-PowerIC:V_REG_LDO: Voltage Regulator LDO Standard 150mA LDO voltage regulator in SOT-23 layout. Micrel part MIC5205. BP (by-pass) pin is used to lower output noise with 470pF cap.
U$1 = gyrolib:A3G4250D
U$2 U$5 = gyrolib:LY330ALH
U$3 = gyrolib:TPS61040
U$4 = gyrolib:L3GD20
Y1 = SparkFun-FreqCtrl:CRYSTAL: Various standard crystals. Proven footprints. Spark Fun Electronics SKU : COM-00534

## Board
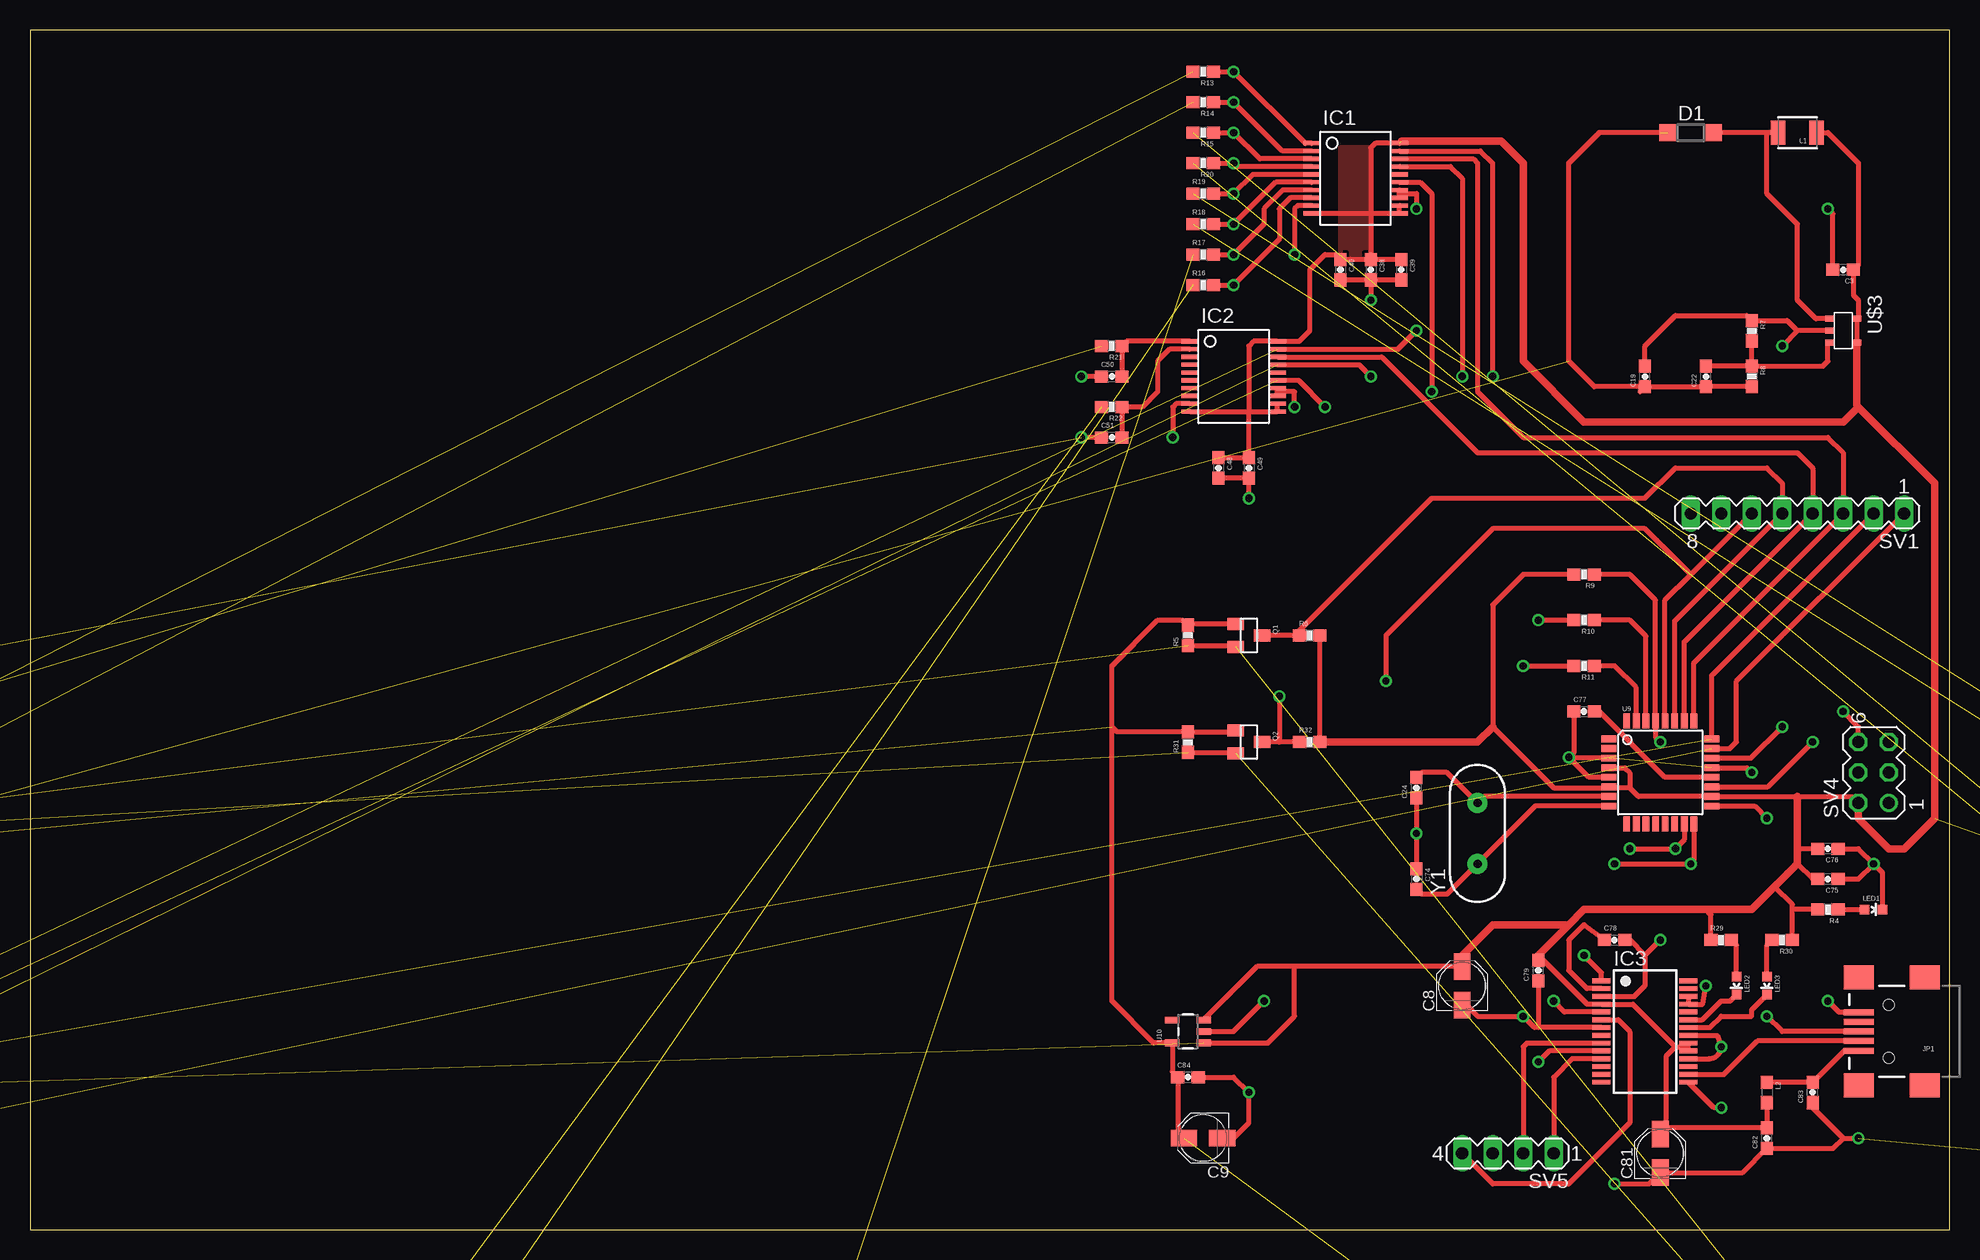
[diagram p9: board, top side]
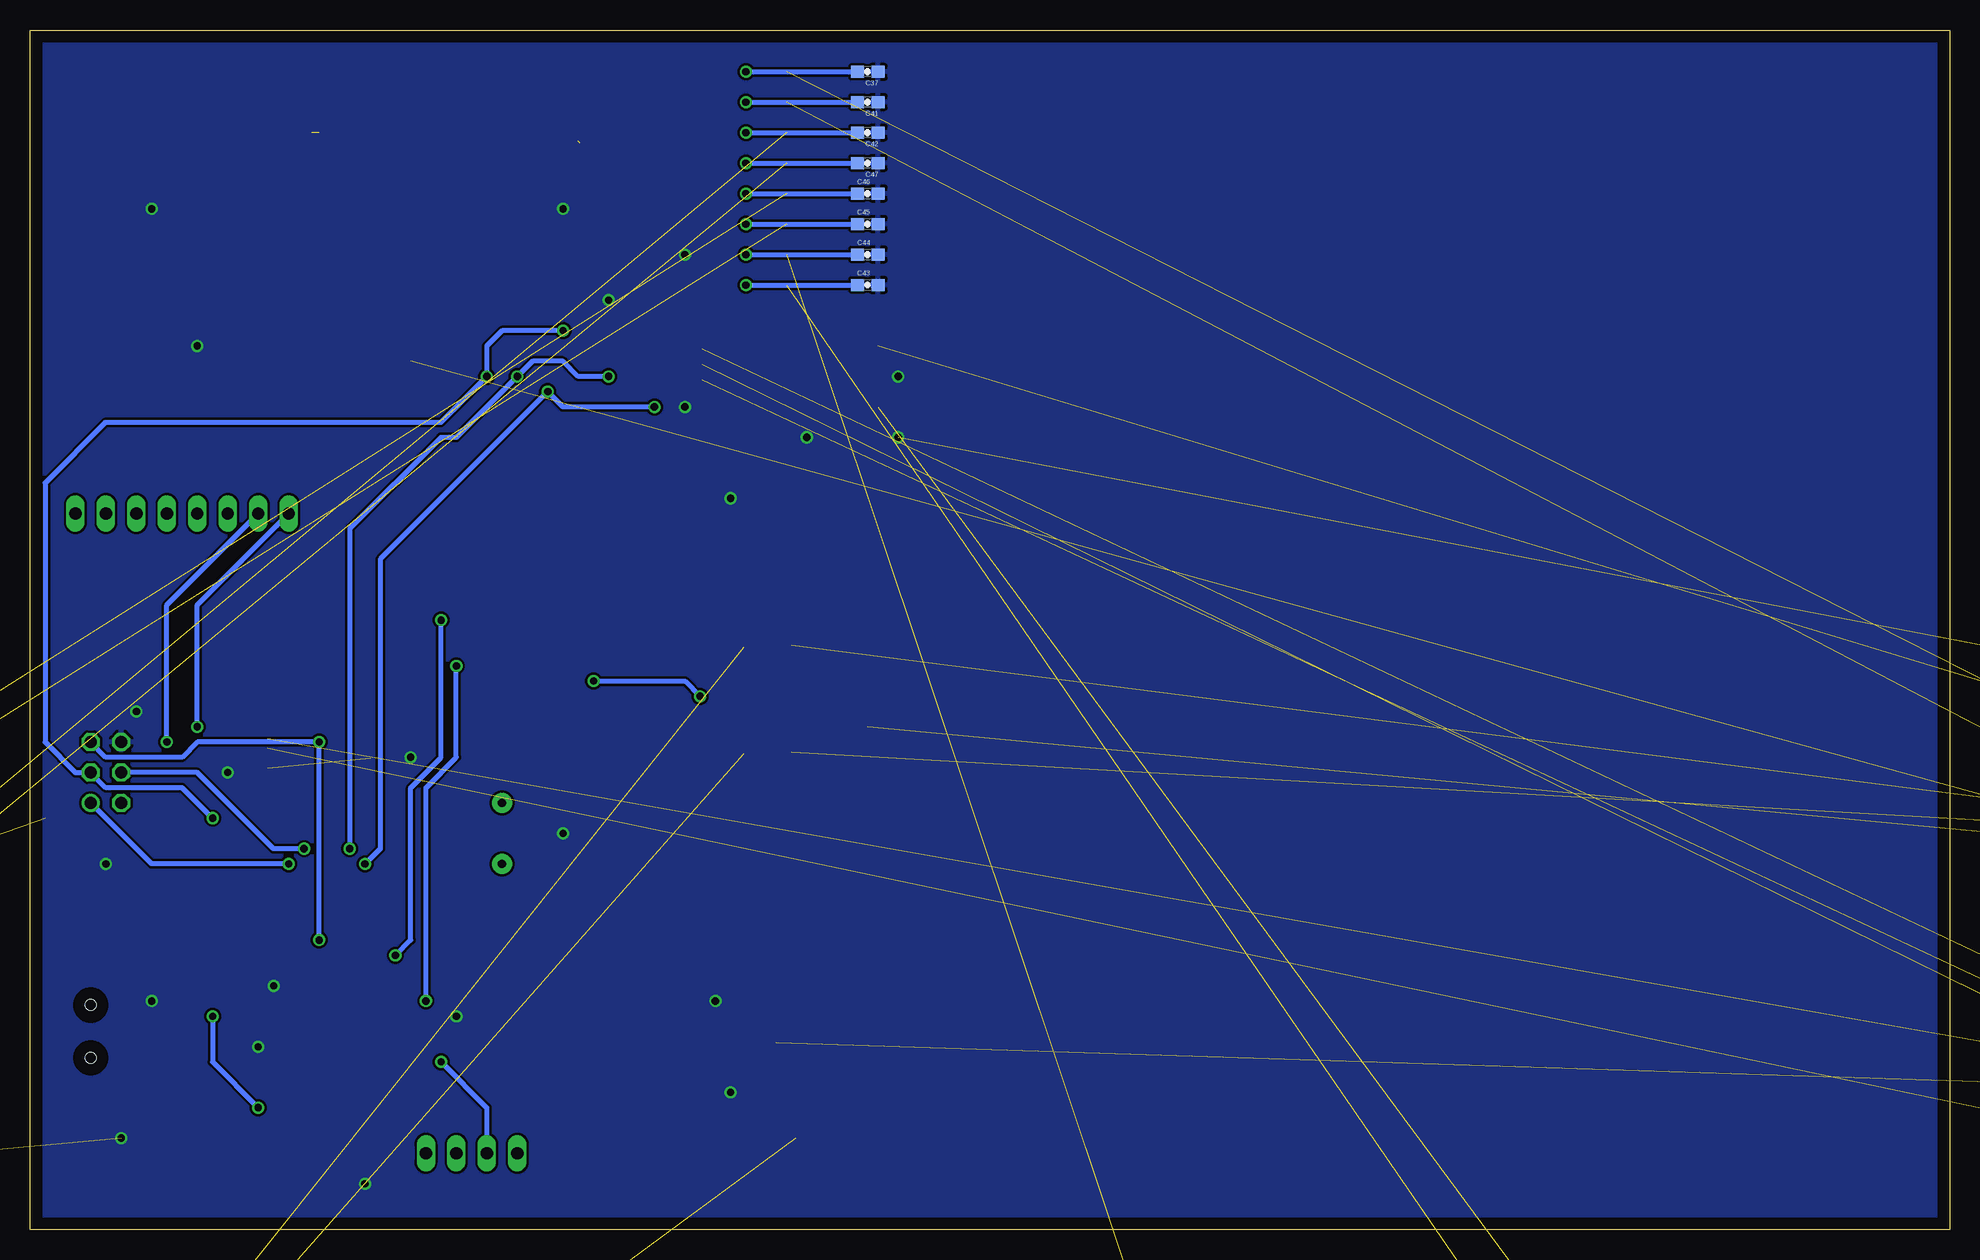
[diagram p10: board, bottom side, seen from below]

Size 160 x 100 mm. Coordinates in mm from the lower left corner, seen from the top.
Outline: 0,0 160,0 160,100 0,100 0,0
Copper layers (1*16): Top 0.035mm / dielectric 1.5mm / Bottom 0.035mm
Design rules: minimum track width 10mil, minimum drill 24mil, track to track 8mil, track to pad 8mil, pad to pad 8mil, via to via 8mil, smd to smd 8mil, copper to edge 40mil, drill to drill 8mil, minimum pad ring 10mil, minimum via ring 8mil, stop-mask expansion 4mil, vias tented up to drill 0mil, thermal gap 10mil

### Footprints (pad centres in the part's own frame; a part is rotated, then mirrored left to right if it is on the bottom)
0603-CAP = smd 1.1 x 1: 1 -0.85,0; 2 0.85,0
PANASONIC_B = smd 2.2 x 1.4: + 1.6,0; - -1.6,0
SOD123 = smd 1.4 x 1.4: A 1.9,0; C -1.9,0
DIODE-1N4001 = drill 1 pad 1.981: A -5.08,0; C 5.08,0
SSOP20BU = smd 0.348 x 1.397: 1 -2.925,-3.656; 2 -2.275,-3.656; 3 -1.625,-3.656; 4 -0.975,-3.656; 5 -0.325,-3.656; 6 0.325,-3.656; 7 0.975,-3.656; 8 1.625,-3.656; 9 2.275,-3.656; 10 2.925,-3.656; 11 2.925,3.656; 12 2.275,3.656; 13 1.625,3.656; 14 0.975,3.656; 15 0.325,3.656; 16 -0.325,3.656; 17 -0.975,3.656; 18 -1.625,3.656; 19 -2.275,3.656; 20 -2.925,3.656
SSOP28 = smd 0.4 x 1.5: 1 -4.225,-3.625; 2 -3.575,-3.625; 3 -2.925,-3.625; 4 -2.275,-3.625; 5 -1.625,-3.625; 6 -0.975,-3.625; 7 -0.325,-3.625; 8 0.325,-3.625; 9 0.975,-3.625; 10 1.625,-3.625; 11 2.275,-3.625; 12 2.925,-3.625; 13 3.575,-3.625; 14 4.225,-3.625; 15 4.225,3.625; 16 3.575,3.625; 17 2.925,3.625; 18 2.275,3.625; 19 1.625,3.625; 20 0.975,3.625; 21 0.325,3.625; 22 -0.325,3.625; 23 -0.975,3.625; 24 -1.625,3.625; 25 -2.275,3.625; 26 -2.925,3.625; 27 -3.575,3.625; 28 -4.225,3.625
USB-MINIB = smd 2.5 x 0.5: D+ 2.5,0; D- 2.5,0.8; GND 2.5,-1.6; ID 2.5,-0.8; VBUS 2.5,1.6 | smd 2.5 x 2: MTN1 -3,4.5; MTN2 2.5,4.5; MTN3 -3,-4.5; MTN4 2.5,-4.5 | hole 0.9: 0,2.2; 0,-2.2
1210 = smd 1.2 x 2: 1 -1.6,0; 2 1.6,0
0603 = smd 1.1 x 1: 1 -0.85,0; 2 0.85,0
LED-0603 = smd 0.8 x 0.8: A 0,-0.75; C 0,0.75
SOT23 = smd 1 x 1.4: 1 -0.95,-1.1; 2 0.95,-1.1; 3 0,1.1
0603-RES = smd 1.1 x 1: 1 -0.85,0; 2 0.85,0
MA08-1 = drill 1.016 long: 1 -8.89,0; 2 -6.35,0; 3 -3.81,0; 4 -1.27,0; 5 1.27,0; 6 3.81,0; 7 6.35,0; 8 8.89,0
MA03-2 = drill 1.016: 1 -2.54,-1.27 | drill 1.016 octagon: 2 -2.54,1.27; 3 0,-1.27; 4 0,1.27; 5 2.54,-1.27; 6 2.54,1.27
MA04-1 = drill 1.016 long: 1 -3.81,0; 2 -1.27,0; 3 1.27,0; 4 3.81,0
LGA_CC-20-1 = smd 0.686 x 0.991: 1 -5.436,3.81; 2 -5.436,1.905; 3 -5.436,0; 4 -5.436,-1.905; 5 -5.436,-3.81; 11 5.436,-3.81; 12 5.436,-1.905; 13 5.436,0; 14 5.436,1.905; 15 5.436,3.81 | smd 0.991 x 0.686: 6 -3.81,-5.359; 7 -1.905,-5.359; 8 0,-5.359; 9 1.905,-5.359; 10 3.81,-5.359; 16 3.81,5.359; 17 1.905,5.359; 18 0,5.359; 19 -1.905,5.359; 20 -3.81,5.359
RG_16_1 = smd 1.575 x 0.813: 1 -4.775,4.445; 2 -4.775,3.175; 3 -4.775,1.905; 4 -4.775,0.635; 5 -4.775,-0.635; 6 -4.775,-1.905; 7 -4.775,-3.175; 8 -4.775,-4.445; 9 4.775,-4.445; 10 4.775,-3.175; 11 4.775,-1.905; 12 4.775,-0.635; 13 4.775,0.635; 14 4.775,1.905; 15 4.775,3.175; 16 4.775,4.445
BG_32_3 = smd 0.356 x 0.356: A2 -1.6,2.388; A3 -0.787,2.388; A4 0,2.388; A5 0.787,2.388; A6 1.6,2.388; B1 -2.388,1.6; B3 -0.787,1.6; B4 0,1.6; B5 0.787,1.6; B7 2.388,1.6; C1 -2.388,0.787; C2 -1.6,0.787; C6 1.6,0.787; C7 2.388,0.787; D1 -2.388,0; D2 -1.6,0; D6 1.6,0; D7 2.388,0; E1 -2.388,-0.787; E2 -1.6,-0.787; E6 1.6,-0.787; E7 2.388,-0.787; F1 -2.388,-1.6; F3 -0.787,-1.6; F4 0,-1.6; F5 0.787,-1.6; F7 2.388,-1.6; G2 -1.6,-2.388; G3 -0.787,-2.388; G4 0,-2.388; G5 0.787,-2.388; G6 1.6,-2.388
LGA16-4X4 = smd 1 x 0.4: 1 -1.85,0.975; 2 -1.85,0.325; 3 -1.85,-0.325; 4 -1.85,-0.975; 9 1.85,-0.975; 10 1.85,-0.325; 11 1.85,0.325; 12 1.85,0.975 | smd 0.4 x 1: 5 -0.975,-1.85; 6 -0.325,-1.85; 7 0.325,-1.85; 8 0.975,-1.85; 13 0.975,1.85; 14 0.325,1.85; 15 -0.325,1.85; 16 -0.975,1.85
TESTING_QFN-24-4MM2 = smd 1.016 x 0.254: 1 -2.066,1.257; 2 -2.066,0.75; 3 -2.066,0.247; 4 -2.066,-0.287; 5 -2.066,-0.792; 6 -2.066,-1.297; 13 2.086,-1.297; 14 2.086,-0.792; 15 2.086,-0.287; 16 2.086,0.247; 17 2.086,0.75; 18 2.086,1.257 | smd 0.254 x 1.016: 7 -1.267,-2.122; 8 -0.762,-2.122; 9 -0.258,-2.122; 10 0.278,-2.122; 11 0.78,-2.122; 12 1.287,-2.122; 19 1.287,2.082; 20 0.78,2.082; 21 0.278,2.082; 22 -0.258,2.082; 23 -0.762,2.082; 24 -1.267,2.082 | smd 2.616 x 2.616: P$1 0.02,-0.01
TQFP32-08 = smd 1.27 x 0.559: 1 -4.293,2.8; 2 -4.293,2; 3 -4.293,1.2; 4 -4.293,0.4; 5 -4.293,-0.4; 6 -4.293,-1.2; 7 -4.293,-2; 8 -4.293,-2.8; 17 4.293,-2.8; 18 4.293,-2; 19 4.293,-1.2; 20 4.293,-0.4; 21 4.293,0.4; 22 4.293,1.2; 23 4.293,2; 24 4.293,2.8 | smd 0.559 x 1.27: 9 -2.8,-4.293; 10 -2,-4.293; 11 -1.2,-4.293; 12 -0.4,-4.293; 13 0.4,-4.293; 14 1.2,-4.293; 15 2,-4.293; 16 2.8,-4.293; 25 2.8,4.293; 26 2,4.293; 27 1.2,4.293; 28 0.4,4.293; 29 -0.4,4.293; 30 -1.2,4.293; 31 -2,4.293; 32 -2.8,4.293
SOT23-5 = smd 0.55 x 1.2: 1 -0.95,-1.3; 2 0,-1.3; 3 0.95,-1.3; 4 0.95,1.3; 5 -0.95,1.3
LGA-16 = smd 0.4 x 0.3: G1 -1.7,0.975; G2 -1.7,0.325; G3 -1.7,-0.325; G4 -1.7,-0.975; G9 1.7,-0.975; G10 1.7,-0.325; G11 1.7,0.325; G12 1.7,0.975 | smd 0.3 x 0.4: G5 -0.975,-1.7; G6 -0.325,-1.7; G7 0.325,-1.7; G8 0.975,-1.7; G13 0.975,1.7; G14 0.325,1.7; G15 -0.325,1.7; G16 -0.975,1.7
LGA-10 = smd 0.635 x 0.6: G1 -2,-1.1; G4 2,-1.1; G5 2,0; G6 2,1.1; G9 -2,1.1; G10 -2,0 | smd 0.7 x 0.6: G2 -0.6,-1.1; G3 0.6,-1.1; G7 0.6,1.1; G8 -0.6,1.1
DBV = smd 0.5 x 0.75: P$1 -1,-1.125; P$2 0,-1.125; P$3 1,-1.125; P$4 1,1.125; P$5 -1,1.125
HC49US = drill 0.7 pad 1.651: 1 -2.54,0; 2 2.54,0

### Placement (x,y rotation side)
C1  -40.64,39.37 0 top  (outside the outline)
C2  -44.45,39.37 0 top  (outside the outline)
C3  151.13,80.01 180 top
C4  -52.07,39.37 0 top  (outside the outline)
C5  -53.34,-31.75 0 top  (outside the outline)
C6  -19.05,45.72 0 top  (outside the outline)
C7  -22.86,45.72 0 top  (outside the outline)
C8  119.38,20.32 90 top
C9  97.79,7.62 180 top
C10  -34.29,45.72 0 top  (outside the outline)
C11  -38.1,45.72 0 top  (outside the outline)
C12  -53.34,-2.54 0 top  (outside the outline)
C13  -53.34,-5.08 0 top  (outside the outline)
C14  -53.34,-7.62 0 top  (outside the outline)
C15  -53.34,-53.34 0 top  (outside the outline)
C16  -53.34,-12.7 0 top  (outside the outline)
C17  -53.34,-15.24 0 top  (outside the outline)
C18  -53.34,-19.05 0 top  (outside the outline)
C19  134.62,71.12 90 top
C20  -53.34,-35.56 0 top  (outside the outline)
C21  179.07,-116.84 0 top  (outside the outline)
C22  139.7,71.12 90 top
C23  179.07,-137.16 0 top  (outside the outline)
C24  115.57,36.83 90 top
C25  -53.34,-124.46 0 top  (outside the outline)
C26  -49.53,-124.46 0 top  (outside the outline)
C27  24.13,-144.78 90 top  (outside the outline)
C28  24.13,-140.97 90 top  (outside the outline)
C29  24.13,-137.16 90 top  (outside the outline)
C30  24.13,-133.35 90 top  (outside the outline)
C31  27.94,-144.78 90 top  (outside the outline)
C32  27.94,-140.97 90 top  (outside the outline)
C33  31.75,-144.78 90 top  (outside the outline)
C34  35.56,-144.78 90 top  (outside the outline)
C35  39.37,-144.78 90 top  (outside the outline)
C36  43.18,-144.78 90 top  (outside the outline)
C37  90.17,96.52 180 bottom
C38  111.76,80.01 270 top
C39  114.3,80.01 270 top
C40  109.22,80.01 270 top
C41  90.17,93.98 180 bottom
C42  90.17,91.44 180 bottom
C43  90.17,78.74 0 bottom
C44  90.17,81.28 0 bottom
C45  90.17,83.82 0 bottom
C46  90.17,86.36 0 bottom
C47  90.17,88.9 180 bottom
C48  99.06,63.5 270 top
C49  101.6,63.5 270 top
C50  90.17,71.12 0 top
C51  90.17,66.04 0 top
C58  208.28,6.35 0 top  (outside the outline)
C59  212.09,6.35 0 top  (outside the outline)
C60  215.9,6.35 0 top  (outside the outline)
C61  219.71,6.35 0 top  (outside the outline)
C62  208.28,2.54 0 top  (outside the outline)
C63  212.09,2.54 0 top  (outside the outline)
C64  208.28,-11.43 0 top  (outside the outline)
C65  212.09,-11.43 0 top  (outside the outline)
C66  215.9,-11.43 0 top  (outside the outline)
C67  219.71,-11.43 0 top  (outside the outline)
C68  208.28,-15.24 0 top  (outside the outline)
C69  212.09,-15.24 0 top  (outside the outline)
C70  213.36,-87.63 0 top  (outside the outline)
C71  207.01,-93.98 0 top  (outside the outline)
C72  179.07,-124.46 0 top  (outside the outline)
C73  207.01,-101.6 0 top  (outside the outline)
C74  115.57,29.21 270 top
C75  149.86,29.21 180 top
C76  149.86,31.75 180 top
C77  129.54,43.18 0 top
C78  132.08,24.13 0 top
C79  125.73,21.59 90 top
C81  135.89,6.35 90 top
C82  144.78,7.62 90 top
C83  148.59,11.43 90 top
C84  96.52,12.7 0 top
D1  138.43,91.44 0 top
D2  -41.91,-22.86 0 top  (outside the outline)
IC1  110.49,87.63 270 top
IC2  100.33,71.12 270 top
IC3  134.62,16.51 270 top
JP1  154.94,16.51 180 top
L1  147.32,91.44 180 top
L2  144.78,11.43 270 top
L3  -52.07,-77.47 0 top  (outside the outline)
LED1  153.67,26.67 270 top
LED2  142.24,20.32 180 top
LED3  144.78,20.32 180 top
Q1  101.6,49.53 270 top
Q2  101.6,40.64 270 top
R1  -45.72,45.72 0 top  (outside the outline)
R2  -49.53,45.72 0 top  (outside the outline)
R3  179.07,-120.65 0 top  (outside the outline)
R4  149.86,26.67 180 top
R5  96.52,49.53 90 top
R6  106.68,49.53 0 top
R7  143.51,74.93 270 top
R8  143.51,71.12 270 top
R9  129.54,54.61 180 top
R10  129.54,50.8 180 top
R11  129.54,46.99 180 top
R12  -45.72,-124.46 0 top  (outside the outline)
R13  97.79,96.52 180 top
R14  97.79,93.98 180 top
R15  97.79,91.44 180 top
R16  97.79,78.74 0 top
R17  97.79,81.28 0 top
R18  97.79,83.82 0 top
R19  97.79,86.36 0 top
R20  97.79,88.9 180 top
R21  90.17,73.66 180 top
R22  90.17,68.58 180 top
R29  140.97,24.13 0 top
R30  146.05,24.13 180 top
R31  96.52,40.64 90 top
R32  106.68,40.64 0 top
SV1  147.32,59.69 180 top
SV4  153.67,38.1 90 top
SV5  123.19,6.35 180 top
U1  -24.13,6.35 0 top  (outside the outline)
U2  -46.99,6.35 0 top  (outside the outline)
U3  -24.13,31.75 0 top  (outside the outline)
U4  -48.26,-132.08 0 top  (outside the outline)
U5  179.07,-110.49 0 top  (outside the outline)
U6  213.36,12.7 0 top  (outside the outline)
U7  213.36,-5.08 0 top  (outside the outline)
U8  180.34,-52.07 0 top  (outside the outline)
U9  135.89,38.1 0 top
U10  96.52,16.51 90 top
U$1  -36.83,31.75 0 top  (outside the outline)
U$2  -46.99,31.75 0 top  (outside the outline)
U$3  151.13,74.93 270 top
U$4  181.61,-130.81 0 top  (outside the outline)
U$5  -50.8,-119.38 0 top  (outside the outline)
Y1  120.65,33.02 90 top

### Tracks (layer width: path | path; a pad name or v marks a point on that pad's centre or on a via)
3.3V  (32 unrouted)
  Top 0.406: C9.+ 95.67,8.14 C84.1 95.22,13.15 U10.5 93.66,15.56 90.17,19.05 90.17,41.91 | Q1.1 96.62,50.48 R5.2 96.1,50.8 93.98,50.8 90.17,46.99 90.17,41.91 | Q2.1 100.4,41.49 R31.2 90.59,41.49 90.17,41.91
5V  (26 unrouted)
  Top 0.406: 137.16,15.24 133.62,18.79 IC3.4 129.81,18.79 125.73,22.86 | 137.16,15.24 137.95,15.24 IC3.20 IC3.19 | SV4.2 151.86,36.1 147.32,36.1 U9.18 134.08,36.1 133.35,36.83 | L2.2 C82.2 136.41,8.47 | 136.41,8.47 C81.+ | 136.41,8.47 136.41,14.49 137.16,15.24 | 133.35,36.83 131.67,36.83 U9.6 131.53,36.83 127,36.83 121.92,41.91 121.92,52.07 124.46,54.61 R9.2 | U9.4 132.95,38.5 133.35,38.1 133.35,36.83 | R30.1 146.9,26.67 | 146.9,26.67 146.9,27.09 145.41,28.57 | R29.1 140.12,26.25 139.7,26.67 | C76.2 147.32,31.75 | C75.2 148.59,29.21 147.32,30.48 | R4.2 146.9,26.67 | C8.+ 105.41,21.92 | 105.41,21.92 102.28,21.92 U10.3 | U10.1 103.19,15.56 105.41,17.78 105.41,21.92 | R32.2 R6.2 | U$3.P$4 U$3.P$5 152.4,76.08 152.4,77.47 151.98,77.89 C3.1 152.4,80.43 152.4,88.9 149.86,91.44 L1.1 | IC1.12 IC1.11 111.76,84.7 | 111.76,84.7 IC1.10 | IC1.20 112.14,90.56 111.76,90.17 111.76,84.7 | C39.1 C38.1 | C38.1 C40.1 108.8,81.28 107.95,81.28 106.68,80.01 106.68,74.93 105.8,74.05 IC2.20 101.98,74.05 101.6,73.66 101.6,68.19 | IC2.10 101.6,68.19 | 101.6,68.19 IC2.11 IC2.12 | 111.76,84.7 C38.1 | C48.1 C49.1 101.6,68.19
  Top 0.61: C79.2 125.73,22.86 128.27,25.4 | 147.32,36.1 147.32,31.75 147.32,30.48 145.41,28.57 143.51,26.67 139.7,26.67 129.54,26.67 128.27,25.4 | C8.+ 119.38,22.86 121.92,25.4 128.27,25.4 | R32.2 120.65,40.64 121.92,41.91 | U$3.P$4 152.25,68.72 152.4,68.58 | 152.4,68.58 158.75,62.23 158.75,34.29 156.21,31.75 154.94,31.75 152.4,34.29 SV4.2 | 152.4,68.58 151.13,67.31 129.54,67.31 124.46,72.39 124.46,88.9 122.65,90.71 114.3,90.71
  pour Top: 109.22,88.9 109.22,81.28 111.76,81.28 111.76,90.17 109.22,90.17
6V  (7 unrouted)
  Top 0.406: R8.2 C22.1 C19.1 | 134.2,69.85 C19.1 | C19.1 130.39,70.27 128.27,72.39 128.27,88.9 130.81,91.44 135.89,91.44
!CS_ADC1
  Top 0.406: U9.25 138.69,47.25 SV1.3 151.13,64.77 149.86,66.04 124.46,66.04 120.65,69.85 120.65,88.9 120.3,89.25 IC1.18
!CS_ADC2
  Top 0.406: U9.26 137.89,48.99 SV1.4 148.59,63.5 147.32,64.77 120.65,64.77 112.67,72.75 IC2.18
!CS_ADIS  (1 unrouted)
  Top 0.406: U9.23 141.7,40.1 142.24,40.64 142.24,45.72 SV1.1
!CS_ADXRS  (1 unrouted)
  Top 0.406: U9.24 140.18,46.2 SV1.2
AREF
  Top 0.406: U9.20 136.29,37.7 130.81,43.18 C77.2
GND  (via drill 0.6)  (105 unrouted)
  Top 0.406: IC3.26 IC3.25 139.44,18.79 v139.7,20.32 | IC3.18 139.97,14.23 arc90 v140.97,15.24 140.65,16.18 IC3.21 | IC3.7 125.73,16.84 | 125.73,16.84 125.41,16.84 v124.46,17.78 120.65,17.78 119.71,18.72 C8.- | C24.1 v115.57,33.02 C74.1 | C79.1 125.73,16.84 | JP1.GND 150.8,18.11 v149.86,19.05 | C83.1 148.59,10.16 151.13,7.62 | 151.13,7.62 v152.4,7.62 | v132.08,3.81 134.95,3.81 C81.- 142.76,4.75 C82.1 150.28,6.77 151.13,7.62 | U9.3 128.34,39.3 v128.27,39.37 | U9.5 129.94,37.7 v128.27,39.37 | SV4.6 152.4,41.91 v151.13,43.18 | U9.21 143.11,38.5 v143.51,38.1 | C76.1 152.4,31.75 v153.67,30.48 | C75.1 152.4,29.21 v153.67,30.48 | C77.1 128.69,39.79 v128.27,39.37 | LED1.C 154.42,29.73 v153.67,30.48 | U10.2 100.33,16.51 v102.87,19.05 | C84.2 100.33,12.7 v101.6,11.43 101.6,8.89 100.33,7.62 C9.- | U$3.P$2 147.32,74.93 | 147.32,74.93 v146.05,73.66 | C3.2 150.28,84.67 v149.86,85.09 | 147.32,74.93 146.47,75.78 R7.1 143.09,76.2 137.16,76.2 134.62,73.66 C19.2 | IC1.14 IC1.13 114.15,86.21 114.3,86.36 115.57,86.36 v115.57,85.09 | C39.2 C38.2 | C38.2 C40.2 | C38.2 v111.76,77.47 | IC1.9 105.67,85.36 105.41,85.09 v105.41,81.28 | IC2.13 IC2.14 104.28,69.85 105.41,69.85 v105.41,68.58 | IC2.9 95.52,68.84 95.25,68.58 v95.25,66.04 | v101.6,60.96 C49.2 C48.2 | C50.1 v87.63,71.12 | C51.1 v87.63,66.04
  pour Bottom: 160.02,100.33 0,100.33 0,0 160.02,0
MISO  (via drill 0.6)  (2 unrouted)
  Top 0.406: U9.16 138.69,30.74 v138.43,30.48 v132.08,30.48 | IC1.15 115.89,87.31 116.84,86.36 v116.84,69.85 | IC2.15 105.73,70.8 v107.95,68.58
  Bottom 0.406: v138.43,30.48 149.86,30.48 SV4.1 | v132.08,30.48 130.81,31.75 130.81,55.88 v116.84,69.85 115.57,68.58 v107.95,68.58
MOSI  (via drill 0.6)  (2 unrouted)
  Top 0.406: U9.15 137.89,32.48 v137.16,31.75 v133.35,31.75 | IC1.17 118.41,88.61 119.38,87.63 v119.38,71.12 | IC2.17 110.78,72.09 v111.76,71.12
  Bottom 0.406: v137.16,31.75 139.7,31.75 146.05,38.1 SV4.4 | v133.35,31.75 133.35,58.42 125.73,66.04 124.46,66.04 v119.38,71.12 118.11,72.39 115.57,72.39 114.3,71.12 v111.76,71.12
N$1  (1 unrouted)
N$2  (1 unrouted)
N$3  (2 unrouted)
N$4  (2 unrouted)
N$5  (2 unrouted)
N$6  (1 unrouted)
N$7  (2 unrouted)
N$8  (2 unrouted)
N$9  (2 unrouted)
N$10  (2 unrouted)
N$11  (2 unrouted)
N$12  (2 unrouted)
N$13  (1 unrouted)
N$14  (1 unrouted)
N$15  (1 unrouted)
N$17  (2 unrouted)
N$18
  Top 0.406: L1.2 144.78,91.44 | 144.78,91.44 D1.A | U$3.P$1 148.86,75.93 147.32,77.47 147.32,83.82 144.78,86.36 144.78,91.44
N$19  (2 unrouted)
N$20
  Top 0.406: R8.1 149.44,71.97 149.86,72.39 149.86,73.78 U$3.P$3 | R8.1 R7.2 | R8.1 C22.2
N$22  (2 unrouted)
N$23  (1 unrouted)
N$24  (2 unrouted)
N$25  (2 unrouted)
N$26  (2 unrouted)
N$27  (2 unrouted)
N$28  (2 unrouted)
N$29  (2 unrouted)
N$30  (via drill 0.6)
  Top 0.406: IC1.1 106.3,90.56 v100.33,96.52 R13.1
  Bottom 0.406: v100.33,96.52 C37.2
N$31  (via drill 0.6)
  Top 0.406: IC1.2 104.41,89.91 v100.33,93.98 R14.1
  Bottom 0.406: v100.33,93.98 C41.2
N$32  (via drill 0.6)
  Top 0.406: IC1.3 102.52,89.25 v100.33,91.44 R15.1
  Bottom 0.406: v100.33,91.44 C42.2
N$33  (via drill 0.6)
  Top 0.406: IC1.8 105.06,86 104.14,85.09 104.14,82.55 v100.33,78.74 R16.2
  Bottom 0.406: v100.33,78.74 C43.1
N$34  (via drill 0.6)
  Top 0.406: IC1.7 104.44,86.66 102.87,85.09 102.87,83.82 v100.33,81.28 R17.2
  Bottom 0.406: v100.33,81.28 C44.1
N$35  (via drill 0.6)
  Top 0.406: IC1.6 103.81,87.31 v100.33,83.82 R18.2
  Bottom 0.406: v100.33,83.82 C45.1
N$36  (via drill 0.6)
  Top 0.406: IC1.4 100.62,88.61 v100.33,88.9 R20.1
  Bottom 0.406: v100.33,88.9 C47.2
N$37  (via drill 0.6)
  Top 0.406: IC1.5 101.92,87.95 v100.33,86.36 R19.2
  Bottom 0.406: v100.33,86.36 C46.1
N$38  (1 unrouted)
N$39  (1 unrouted)
N$41  (1 unrouted)
N$45  (via drill 0.6)
  Top 0.406: U9.19 144.85,36.9 v148.59,40.64
  Bottom 0.406: v148.59,40.64 148.59,52.07 SV1.7
N$46
  Top 0.406: C50.2 R21.1 91.41,74.05 IC2.1
N$47
  Top 0.406: C51.2 R22.1 92.71,68.58 93.98,69.85 93.98,72.39 94.98,73.39 IC2.2
N$54  (via drill 0.6)
  Top 0.406: U9.22 143.44,39.3 v146.05,41.91
  Bottom 0.406: v146.05,41.91 146.05,52.07 SV1.8
N$55  (via drill 0.6)
  Top 0.406: IC3.1 131,21.41 v129.54,22.86 | v125.73,50.8 R10.2
  Bottom 0.406: v129.54,22.86 128.27,24.13 128.27,36.83 125.73,39.37 v125.73,50.8
N$62  (2 unrouted)
N$63  (2 unrouted)
N$64  (2 unrouted)
N$65  (2 unrouted)
N$66  (2 unrouted)
N$67  (2 unrouted)
N$68  (2 unrouted)
N$69  (2 unrouted)
N$70  (2 unrouted)
N$71  (2 unrouted)
N$72  (2 unrouted)
N$73  (2 unrouted)
N$74
  Top 0.406: C78.1 129.54,25.4 128.27,24.13 128.27,21.59 129.78,20.09 IC3.2
N$84  (via drill 0.6)
  Top 0.406: IC3.5 127.92,18.14 v127,19.05 | v124.46,46.99 R11.2
  Bottom 0.406: v127,19.05 127,36.83 124.46,39.37 v124.46,46.99
N$85
  Top 0.406: IC3.11 128.53,14.23 127,12.7 SV5.1
N$86
  Top 0.406: IC3.9 124.75,15.54 124.46,15.24 SV5.2
N$87
  Top 0.406: U9.7 121.19,36.1 Y1.2 118.11,38.1 115.99,38.1 C24.2
N$88
  Top 0.406: U9.8 125.47,35.3 Y1.1 118.11,27.94 115.99,27.94 C74.2
N$89
  Top 0.406: R4.1 LED1.A
N$91  (via drill 0.6)
  Top 0.406: IC3.10 126.64,14.88 v125.73,13.97
  Bottom 0.406: v125.73,13.97 121.92,10.16 SV5.3
N$92
  Top 0.406: IC3.6 132.38,17.48 133.35,16.51 133.35,8.89 128.27,3.81 121.92,3.81 SV5.4
N$93
  Top 0.406: IC3.23 139.41,17.48 140.97,19.05 141.72,19.05 LED2.C
N$94
  Top 0.406: IC3.22 140.03,16.84 140.97,17.78 143.51,17.78 143.51,18.3 LED3.C
N$95
  Top 0.406: LED2.A 142.24,23.71 R29.2
N$96
  Top 0.406: LED3.A 144.78,23.71 R30.2
N$98  (via drill 0.6)
  Top 0.406: JP1.D+ 146.05,16.51 v144.78,17.78 | v140.97,10.16 140.37,10.16 IC3.15
  Bottom 0.406: v144.78,17.78 144.78,13.97 v140.97,10.16
N$99
  Top 0.406: IC3.16 141.21,12.94 143.98,15.71 JP1.D-
N$101
  Top 0.406: JP1.VBUS 151.22,14.91 C83.2 L2.1
OUTZ_ADXRS622  (3 unrouted)
OUTZ_ADXRS642  (3 unrouted)
OUTZ_ADXRS646  (3 unrouted)
OUTZ_ADXRS652  (3 unrouted)
OUTZ_LY330  (1 unrouted)
OUTZ_LY3200  (1 unrouted)
RESET  (via drill 0.6)
  Top 0.406: v135.89,40.64 135.49,41.04 U9.29 135.49,52.47 133.35,54.61 R9.1 | IC3.3 133.74,19.43 134.62,20.32 134.62,22.86 | C78.2 133.35,24.13 134.62,22.86 | 134.62,22.86 v135.89,24.13
  Bottom 0.406: SV4.5 153.67,39.37 147.32,39.37 146.05,40.64 v135.89,40.64 v135.89,24.13
RXD
  Top 0.406: U9.30 134.69,49.46 133.35,50.8 R10.1
SCL_3.3V  (4 unrouted)
  Top 0.406: R31.1 100.4,39.79 Q2.2
SCL_5V  (via drill 0.6)
  Top 0.406: 138.43,54.61 SV1.6 | R32.1 104.14,40.64 | 104.14,40.64 Q2.3 | U9.28 136.29,52.47 138.43,54.61 | 138.43,54.61 134.62,58.42 121.92,58.42 113.03,49.53 v113.03,45.72 | v104.14,44.45 104.14,40.64
  Bottom 0.406: v113.03,45.72 105.41,45.72 v104.14,44.45
SCLK  (via drill 0.6)  (2 unrouted)
  Top 0.406: U9.17 143.77,35.3 v144.78,34.29 | IC1.19 120.92,89.91 121.92,88.9 v121.92,71.12 | IC2.19 114.03,73.39 v115.57,74.93
  Bottom 0.406: v144.78,34.29 147.32,36.83 153.67,36.83 SV4.3 156.21,38.1 158.75,40.64 158.75,62.23 153.67,67.31 125.73,67.31 v121.92,71.12 121.92,73.66 120.65,74.93 v115.57,74.93
SDA_3.3V  (4 unrouted)
  Top 0.406: R5.1 100.4,48.68 Q1.2
SDA_5V
  Top 0.406: U9.27 137.09,50.73 SV1.5 146.05,62.23 144.78,63.5 137.16,63.5 134.62,60.96 116.84,60.96 105.41,49.53 | 105.41,49.53 Q1.3 | R6.1 105.41,49.53
TEMP_ADXRS622  (2 unrouted)
TEMP_ADXRS642  (2 unrouted)
TEMP_ADXRS646  (2 unrouted)
TEMP_ADXRS652  (2 unrouted)
TXD
  Top 0.406: U9.31 133.89,45.18 132.08,46.99 R11.1